# Altium project LIC_EPD_MB.PrjPcb
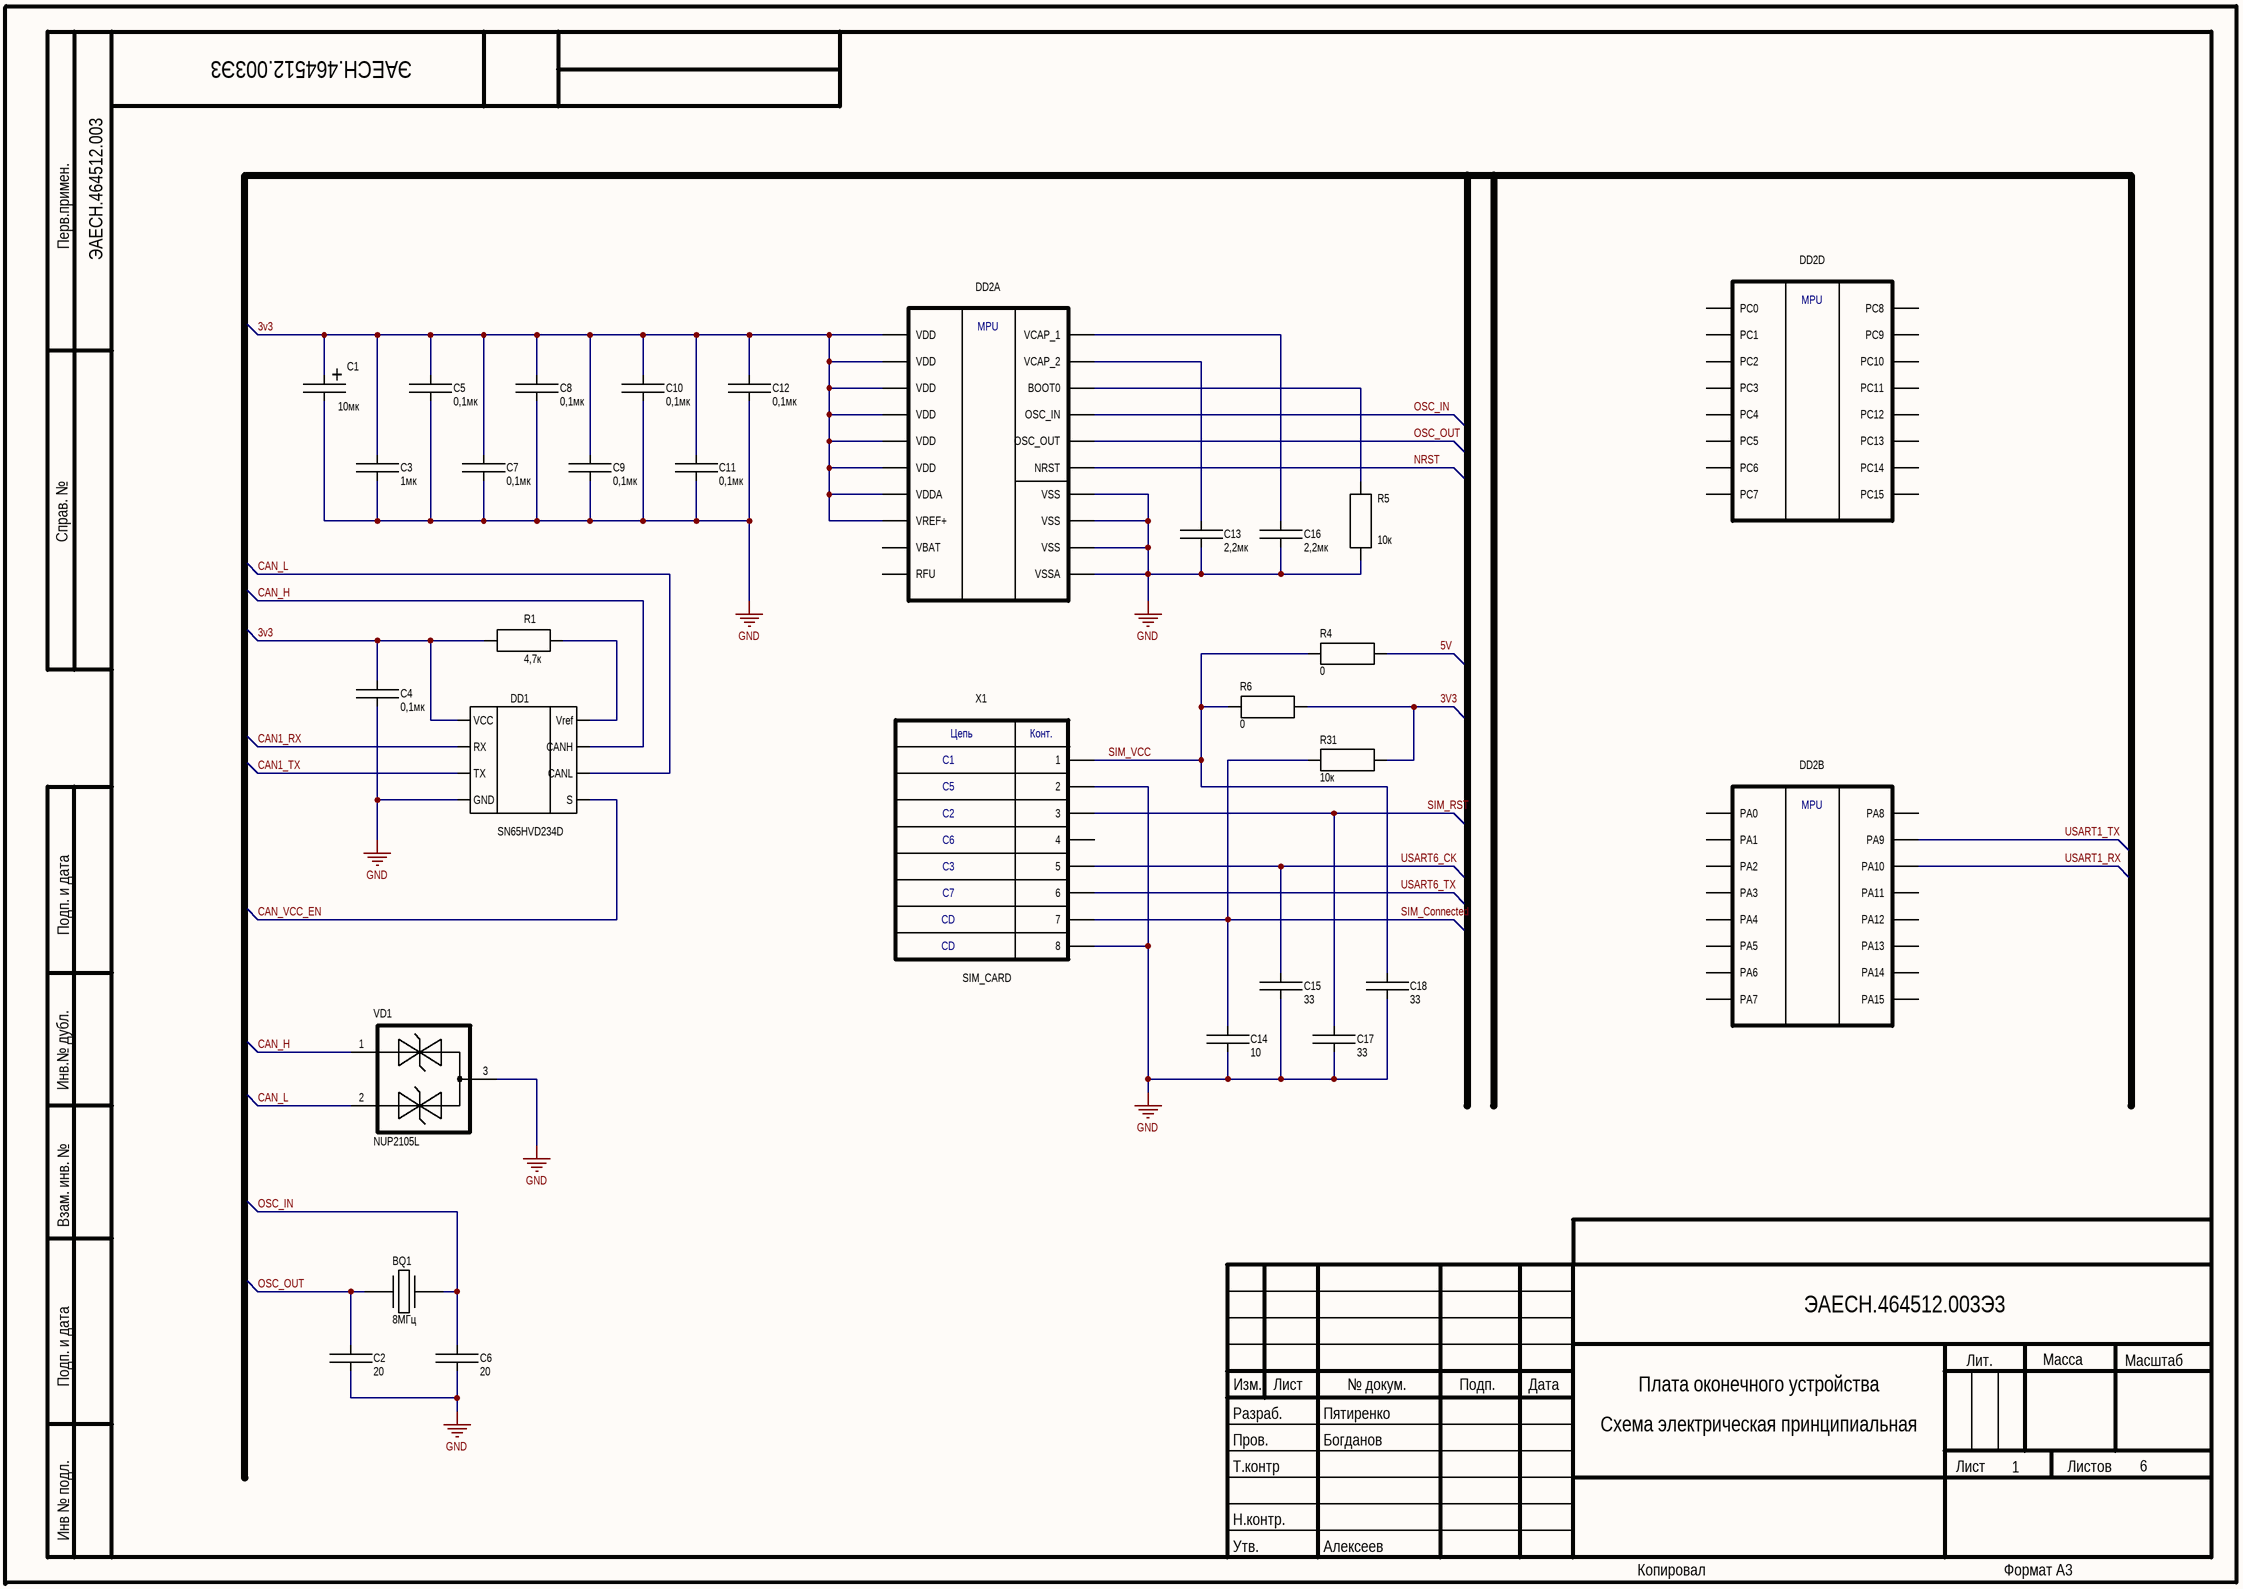
[diagram p0: Sheet1.SchDoc]
6 sheets, 190 parts. Net scope: global (net labels, ports and power ports of the same name join across sheets).
Board file: PCB1.PcbDoc
Sheets:
  Sheet1.SchDoc
  Sheet2.SchDoc
  Sheet3.SchDoc
  Sheet4.SchDoc
  Sheet5.SchDoc
  Sheet6.SchDoc

## Sheet Sheet1.SchDoc: Плата оконечного устройства
size 420 x 297 mm; ApprovedBy: Алексеев; CheckedBy: Богданов; Author: Пятиренко; DrawnBy: Пятиренко; DocumentNumber: ЭАЕСН.464512.003Э3; SheetNumber: 1; SheetTotal: 6; PERVICH PRIM: ЭАЕСН.464512.003; Title2: Схема электрическая принципиальная; DocumentName: Sheet1.SCHDOC; Application_BuildNumber: sdfsdfsdfsdfsdfs

### Parts
BQ1  value 8МГц  [Crystal_0532]  (hidden comment: Quarz)
C1  value 10мк  [Case A]  (hidden comment: C_el)
C2  value 20  [С0603]  (hidden comment: C)
C3  value 1мк  [С0603]  (hidden comment: C)
C4  value 0,1мк  [С0603]  (hidden comment: C)
C5  value 0,1мк  [С0603]  (hidden comment: C)
C6  value 20  [С0603]  (hidden comment: C)
C7  value 0,1мк  [С0603]  (hidden comment: C)
C8  value 0,1мк  [С0603]  (hidden comment: C)
C9  value 0,1мк  [С0603]  (hidden comment: C)
C10  value 0,1мк  [С0603]  (hidden comment: C)
C11  value 0,1мк  [С0603]  (hidden comment: C)
C12  value 0,1мк  [С0603]  (hidden comment: C)
C13  value 2,2мк  [С0603]  (hidden comment: C)
C14  value 10  [С0603]  (hidden comment: C)
C15  value 33  [С0603]  (hidden comment: C)
C16  value 2,2мк  [С0603]  (hidden comment: C)
C17  value 33  [С0603]  (hidden comment: C)
C18  value 33  [С0603]  (hidden comment: C)
DD1  SN65HVD234D  [SOIC8]
DD2  STM32F207VCTx  [LQFP100]  (value not drawn)  (parts A,B,D of 6)
R1  value 4,7к  [R0603]  (hidden comment: R)
R4  value 0  [R0603]  (hidden comment: R)
R5  value 10к  [R0603]  (hidden comment: R)
R6  value 0  [R0603]  (hidden comment: R)
R31  value 10к  [R0603]  (hidden comment: R)
VD1  NUP2105L  [SOT-23]
X1  SIM_CARD  [SIM_CARD_READER2]

### Nets
GND: C1.2 C2.2 C3.2 C4.2 C5.2 C6.2 C7.2 C8.2 C9.2 C10.2 C11.2 C12.2 C13.2 C14.2 C15.2 C16.2 C17.2 C18.2 DD1.2(GND) DD2.10(VSS) DD2.20(VSSA) DD2.27(VSS) DD2.74(VSS) R5.2 VD1.3(AC) X1.2 X1.8
3v3: C1.1 C3.1 C4.1 C5.1 C7.1 C8.1 C9.1 C10.1 C11.1 C12.1 DD1.3(VCC) DD2.11(VDD) DD2.19(VDD) DD2.21(VREF+) DD2.22(VDDA) DD2.28(VDD) DD2.50(VDD) DD2.75(VDD) DD2.100(VDD) R1.1 R6.2 R31.2
5V: R4.2
CAN1_RX: DD1.4(RX)
CAN1_TX: DD1.1(TX)
CAN_H: DD1.7(CANH) VD1.1(A)
CAN_L: DD1.6(CANL) VD1.2(C)
CAN_VCC_EN: DD1.8(S)
NRST: DD2.14(NRST)
OSC_IN: BQ1.2 C6.1 DD2.12(OSC_IN)
OSC_OUT: BQ1.1 C2.1 DD2.13(OSC_OUT)
SIM_Connected: C14.1 R31.1 X1.7
SIM_RST: C17.1 X1.3
SIM_VCC: C18.1 R4.1 R6.1 X1.1
USART1_RX: DD2.69(PA10)
USART1_TX: DD2.68(PA9)
USART6_CK: C15.1 X1.5
USART6_TX: X1.6
NetC13_1: C13.1 DD2.73(VCAP_2)
NetC16_1: C16.1 DD2.49(VCAP_1)
NetDD1_5: DD1.5(Vref) R1.2
NetDD2_94: DD2.94(BOOT0) R5.1

Not connected (* = marked no-connect by the designer): DD2 6(VBAT) 7(PC13) 8(PC14) 9(PC15) 15(PC0) 16(PC1) 17(PC2) 18(PC3) 23(PA0) 24(PA1) 25(PA2) 26(PA3) 29(PA4) 30(PA5) 31(PA6) 32(PA7) 33(PC4) 34(PC5) 63(PC6) 64(PC7) 65(PC8) 66(PC9) 67(PA8) 70(PA11) 71(PA12) 72(PA13) 76(PA14) 77(PA15) 78(PC10) 79(PC11) 80(PC12) 99(RFU); X1 4

### Notes on the sheet
- Перв.примен.
- Справ. №
- Подп. и дата
- Инв.№ дубл.
- Взам. инв. №
- Изм.
- Лист
- № докум.
- Подп.
- Дата
- Лит.
- Масса
- Масштаб
- Пров.
- Т.контр
- Разраб.
- Листов
- Инв № подл.
- Н.контр.
- Утв.
- Копировал
- Формат А3
- (in symbol C_el) +
- (in symbol SIM_CARD) Цепь; Конт.; С1; С5; С2; С6; С3; C7; CD
- (in symbol STM32F207VCTx, part A) MPU
- (in symbol STM32F207VCTx, part B) MPU
- (in symbol STM32F207VCTx, part D) MPU

## Sheet Sheet2.SchDoc
size 420 x 297 mm; DocumentNumber: ЭАЕСН.464512.003Э3; SheetNumber: 2; SheetTotal: x; DocumentName: Sheet1.SCHDOC
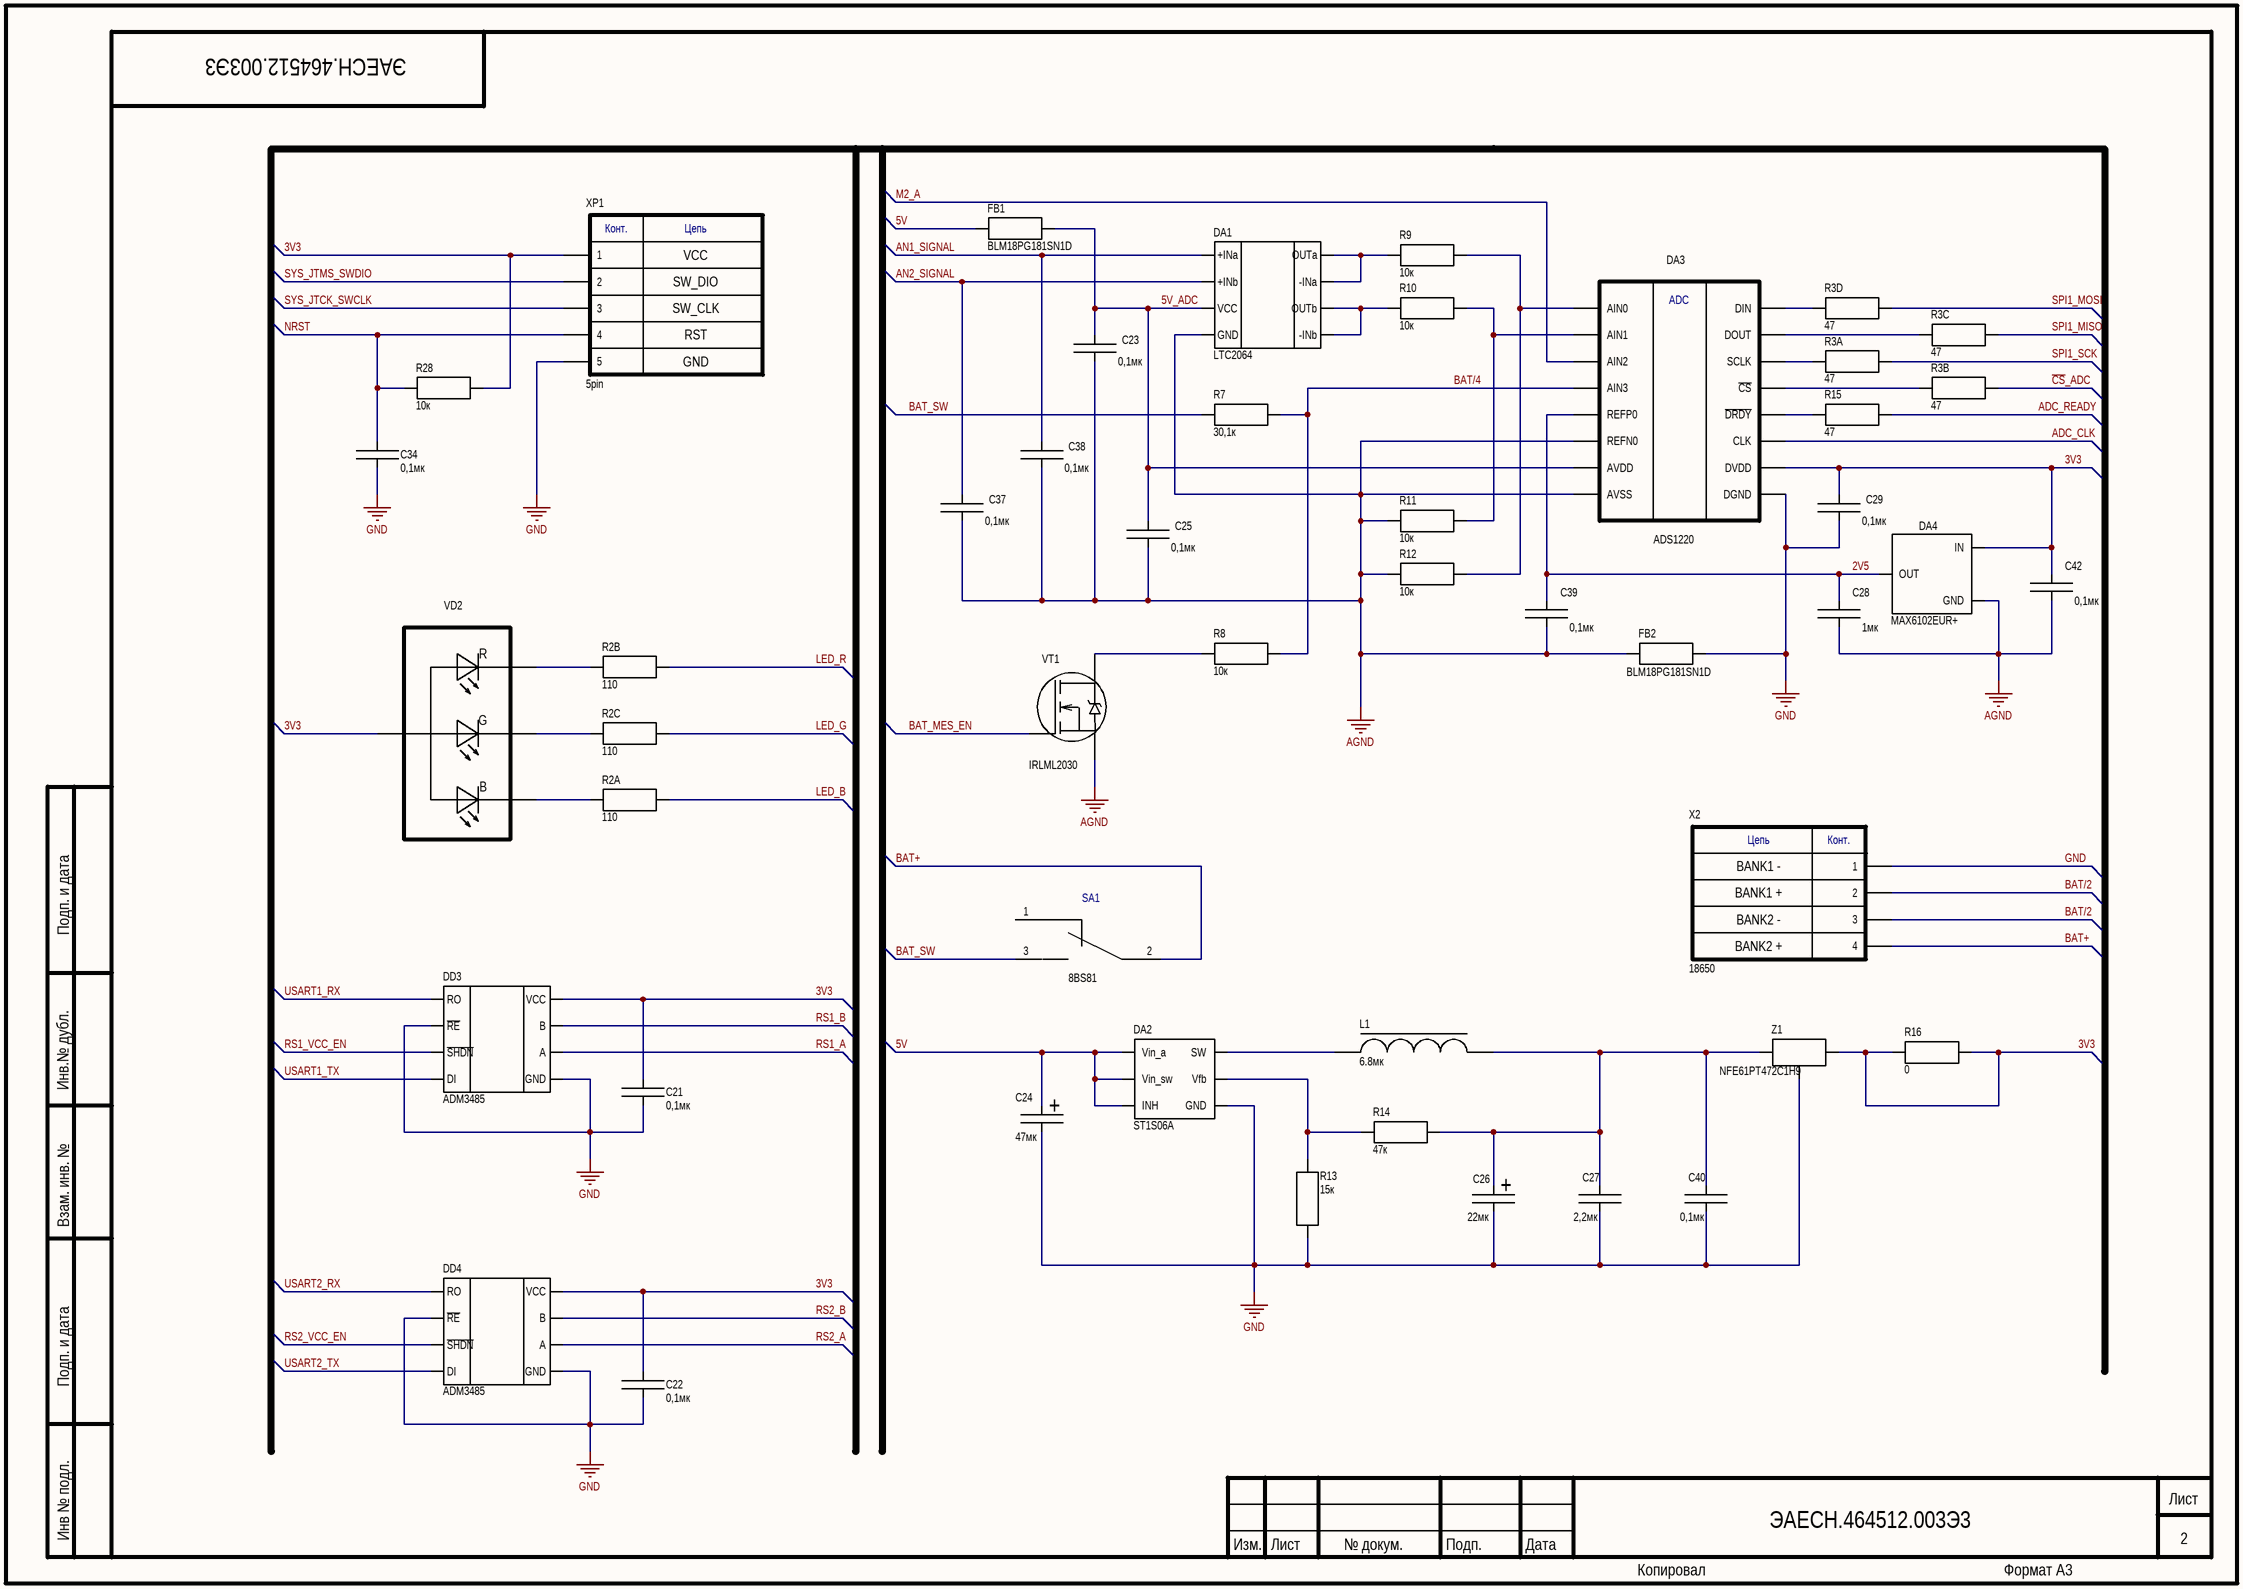
[diagram p1: Sheet2.SchDoc]

### Parts
C21  value 0,1мк  [С0603]  (hidden comment: C)
C22  value 0,1мк  [С0603]  (hidden comment: C)
C23  value 0,1мк  [С0603]  (hidden comment: C)
C24  value 47мк  [CASE B]  (hidden comment: C_el)
C25  value 0,1мк  [С0603]  (hidden comment: C)
C26  value 22мк  [Case A]  (hidden comment: C_el)
C27  value 2,2мк  [С0603]  (hidden comment: C)
C28  value 1мк  [С0603]  (hidden comment: C)
C29  value 0,1мк  [С0603]  (hidden comment: C)
C34  value 0,1мк  [С0603]  (hidden comment: C)
C37  value 0,1мк  [С0603]  (hidden comment: C)
C38  value 0,1мк  [С0603]  (hidden comment: C)
C39  value 0,1мк  [С0603]  (hidden comment: C)
C40  value 0,1мк  [С0603]  (hidden comment: C)
C42  value 0,1мк  [С0603]  (hidden comment: C)
DA1  LTC2064  [MSOP8]
DA2  ST1S06A  [DFN6]
DA3  ADS1220  [TSSOP-16]
DA4  MAX6102EUR+  [SOT-23]
DD3  ADM3485  [SOIC8]
DD4  ADM3485  [SOIC8]
FB1  BLM18PG181SN1D  [R0603]
FB2  BLM18PG181SN1D  [R0603]
L1  6.8мк  [Ind_6.5x6.5]
R2  value 110  [CAT16]  (hidden comment: RES_4)  (parts A,B,C of 4)
R3  value 47  [CAT16]  (hidden comment: RES_4)  (parts A,B,C,D of 4)
R7  value 30,1к  [R0603]  (hidden comment: R)
R8  value 10к  [R0603]  (hidden comment: R)
R9  value 10к  [R0603]  (hidden comment: R)
R10  value 10к  [R0603]  (hidden comment: R)
R11  value 10к  [R0603]  (hidden comment: R)
R12  value 10к  [R0603]  (hidden comment: R)
R13  value 15к  [R0603]  (hidden comment: R)
R14  value 47к  [R0603]  (hidden comment: R)
R15  value 47  [R0603]  (hidden comment: R)
R16  value 0  [R1206]  (hidden comment: R)
R28  value 10к  [R0603]  (hidden comment: R)
SA1  8BS81  [SMTS-102]
VD2  FYLS-3528RGBC  [LED_RGB]  (value not drawn)
VT1  IRLML2030  [SOT-23]
X2  18650  [18650_holder]
XP1  5pin  [PLS-5]
Z1  NFE61PT472C1H9  [NFE61P]

### Nets
AGND: C23.2 C25.2 C28.2 C37.2 C38.2 C39.2 C42.2 DA1.4(GND) DA3.5(AVSS) DA3.8(REFN0) DA4.3(GND) FB2.1 R11.2 R12.2 VT1.2(S)
GND: C21.2 C22.2 C24.2 C26.2 C27.2 C29.2 C34.2 C40.2 DA2.2(GND) DA3.4(DGND) DD3.2(~{RE}) DD3.5(GND) DD4.2(~{RE}) DD4.5(GND) FB2.2 R13.1 X2.1 XP1.5 Z1.3(GND)
2V5: C28.1 C39.1 DA3.9(REFP0) DA4.2(OUT)
3v3: C21.1 C22.1 C29.1 C42.1 DA3.13(DVDD) DA4.1(IN) DD3.8(VCC) DD4.8(VCC) R16.1 R16.2 R28.2 VD2.2 XP1.1 Z1.2
5V: C24.1 DA2.4(Vin_sw) DA2.5(Vin_a) DA2.6(INH) FB1.2
5V_ADC: C23.1 C25.1 DA1.8(VCC) DA3.12(AVDD) FB1.1
ADC_CLK: DA3.3(CLK)
ADC_READY: R15.2
AN1_SIGNAL: C38.1 DA1.3(+INa)
AN2_SIGNAL: C37.1 DA1.5(+INb)
BAT+: SA1.2 X2.4
BAT/2: X2.2 X2.3
BAT/4: DA3.6(AIN3) R7.2 R8.2
BAT_MES_EN: VT1.1(G)
BAT_SW: R7.1 SA1.3
~{CS}_ADC: R3.7
LED_B: R2.8
LED_G: R2.6
LED_R: R2.7
M2_A: DA3.7(AIN2)
NRST: C34.1 R28.1 XP1.4
RS1_A: DD3.6(A)
RS1_B: DD3.7(B)
RS1_VCC_EN: DD3.3(~{SHDN})
RS2_A: DD4.6(A)
RS2_B: DD4.7(B)
RS2_VCC_EN: DD4.3(~{SHDN})
SPI1_MISO: R3.6
SPI1_MOSI: R3.5
SPI1_SCK: R3.8
SYS_JTCK_SWCLK: XP1.3
SYS_JTMS_SWDIO: XP1.2
USART1_RX: DD3.1(RO)
USART1_TX: DD3.4(DI)
USART2_RX: DD4.1(RO)
USART2_TX: DD4.4(DI)
NetC26_1: C26.1 C27.1 C40.1 L1.1 R14.2 Z1.1
NetDA1_1: DA1.1(OUTa) DA1.2(-INa) R9.1
NetDA1_6: DA1.6(-INb) DA1.7(OUTb) R10.1
NetDA2_1: DA2.1(Vfb) R13.2 R14.1
NetDA2_3: DA2.3(SW) L1.2
NetDA3_1: DA3.1(SCLK) R3.1
NetDA3_2: DA3.2(~{CS}) R3.2
NetDA3_10: DA3.10(AIN1) R10.2 R11.1
NetDA3_11: DA3.11(AIN0) R9.2 R12.1
NetDA3_14: DA3.14(~{DRDY}) R15.1
NetDA3_15: DA3.15(DOUT) R3.3
NetDA3_16: DA3.16(DIN) R3.4
NetR2_1: R2.1 VD2.3
NetR2_2: R2.2 VD2.1
NetR2_3: R2.3 VD2.4
NetR8_1: R8.1 VT1.3(D)

Not connected (* = marked no-connect by the designer): SA1 1

### Notes on the sheet
- VCC
- SW_DIO
- SW_CLK
- RST
- GND
- Подп. и дата
- Инв.№ дубл.
- Взам. инв. №
- Инв № подл.
- Изм.
- Лист
- № докум.
- Подп.
- Дата
- Копировал
- Формат А3
- (in symbol 5pin) Конт.; Цепь
- (in symbol 18650_holder) Цепь; Конт.; BANK1 -; BANK1 +; BANK2 -; BANK2 +
- (in symbol ADC1220) ADC
- (in symbol C_el) +
- (in symbol LED_RGB) R; G; B

### Library data of the parts
DA3 = ADC1220
DD3 DD4 = MAX13487: RS485
FB1 FB2 = R: Value: 0
L1 = L
SA1 = Button
VD2 = LED_RGB
VT1 = N-channel
X2 = 18650_holder
Z1 = Filter

## Sheet Sheet3.SchDoc
size 420 x 297 mm; DocumentNumber: ЭАЕСН.464512.003Э3; SheetNumber: 3; SheetTotal: x; DocumentName: Sheet1.SCHDOC
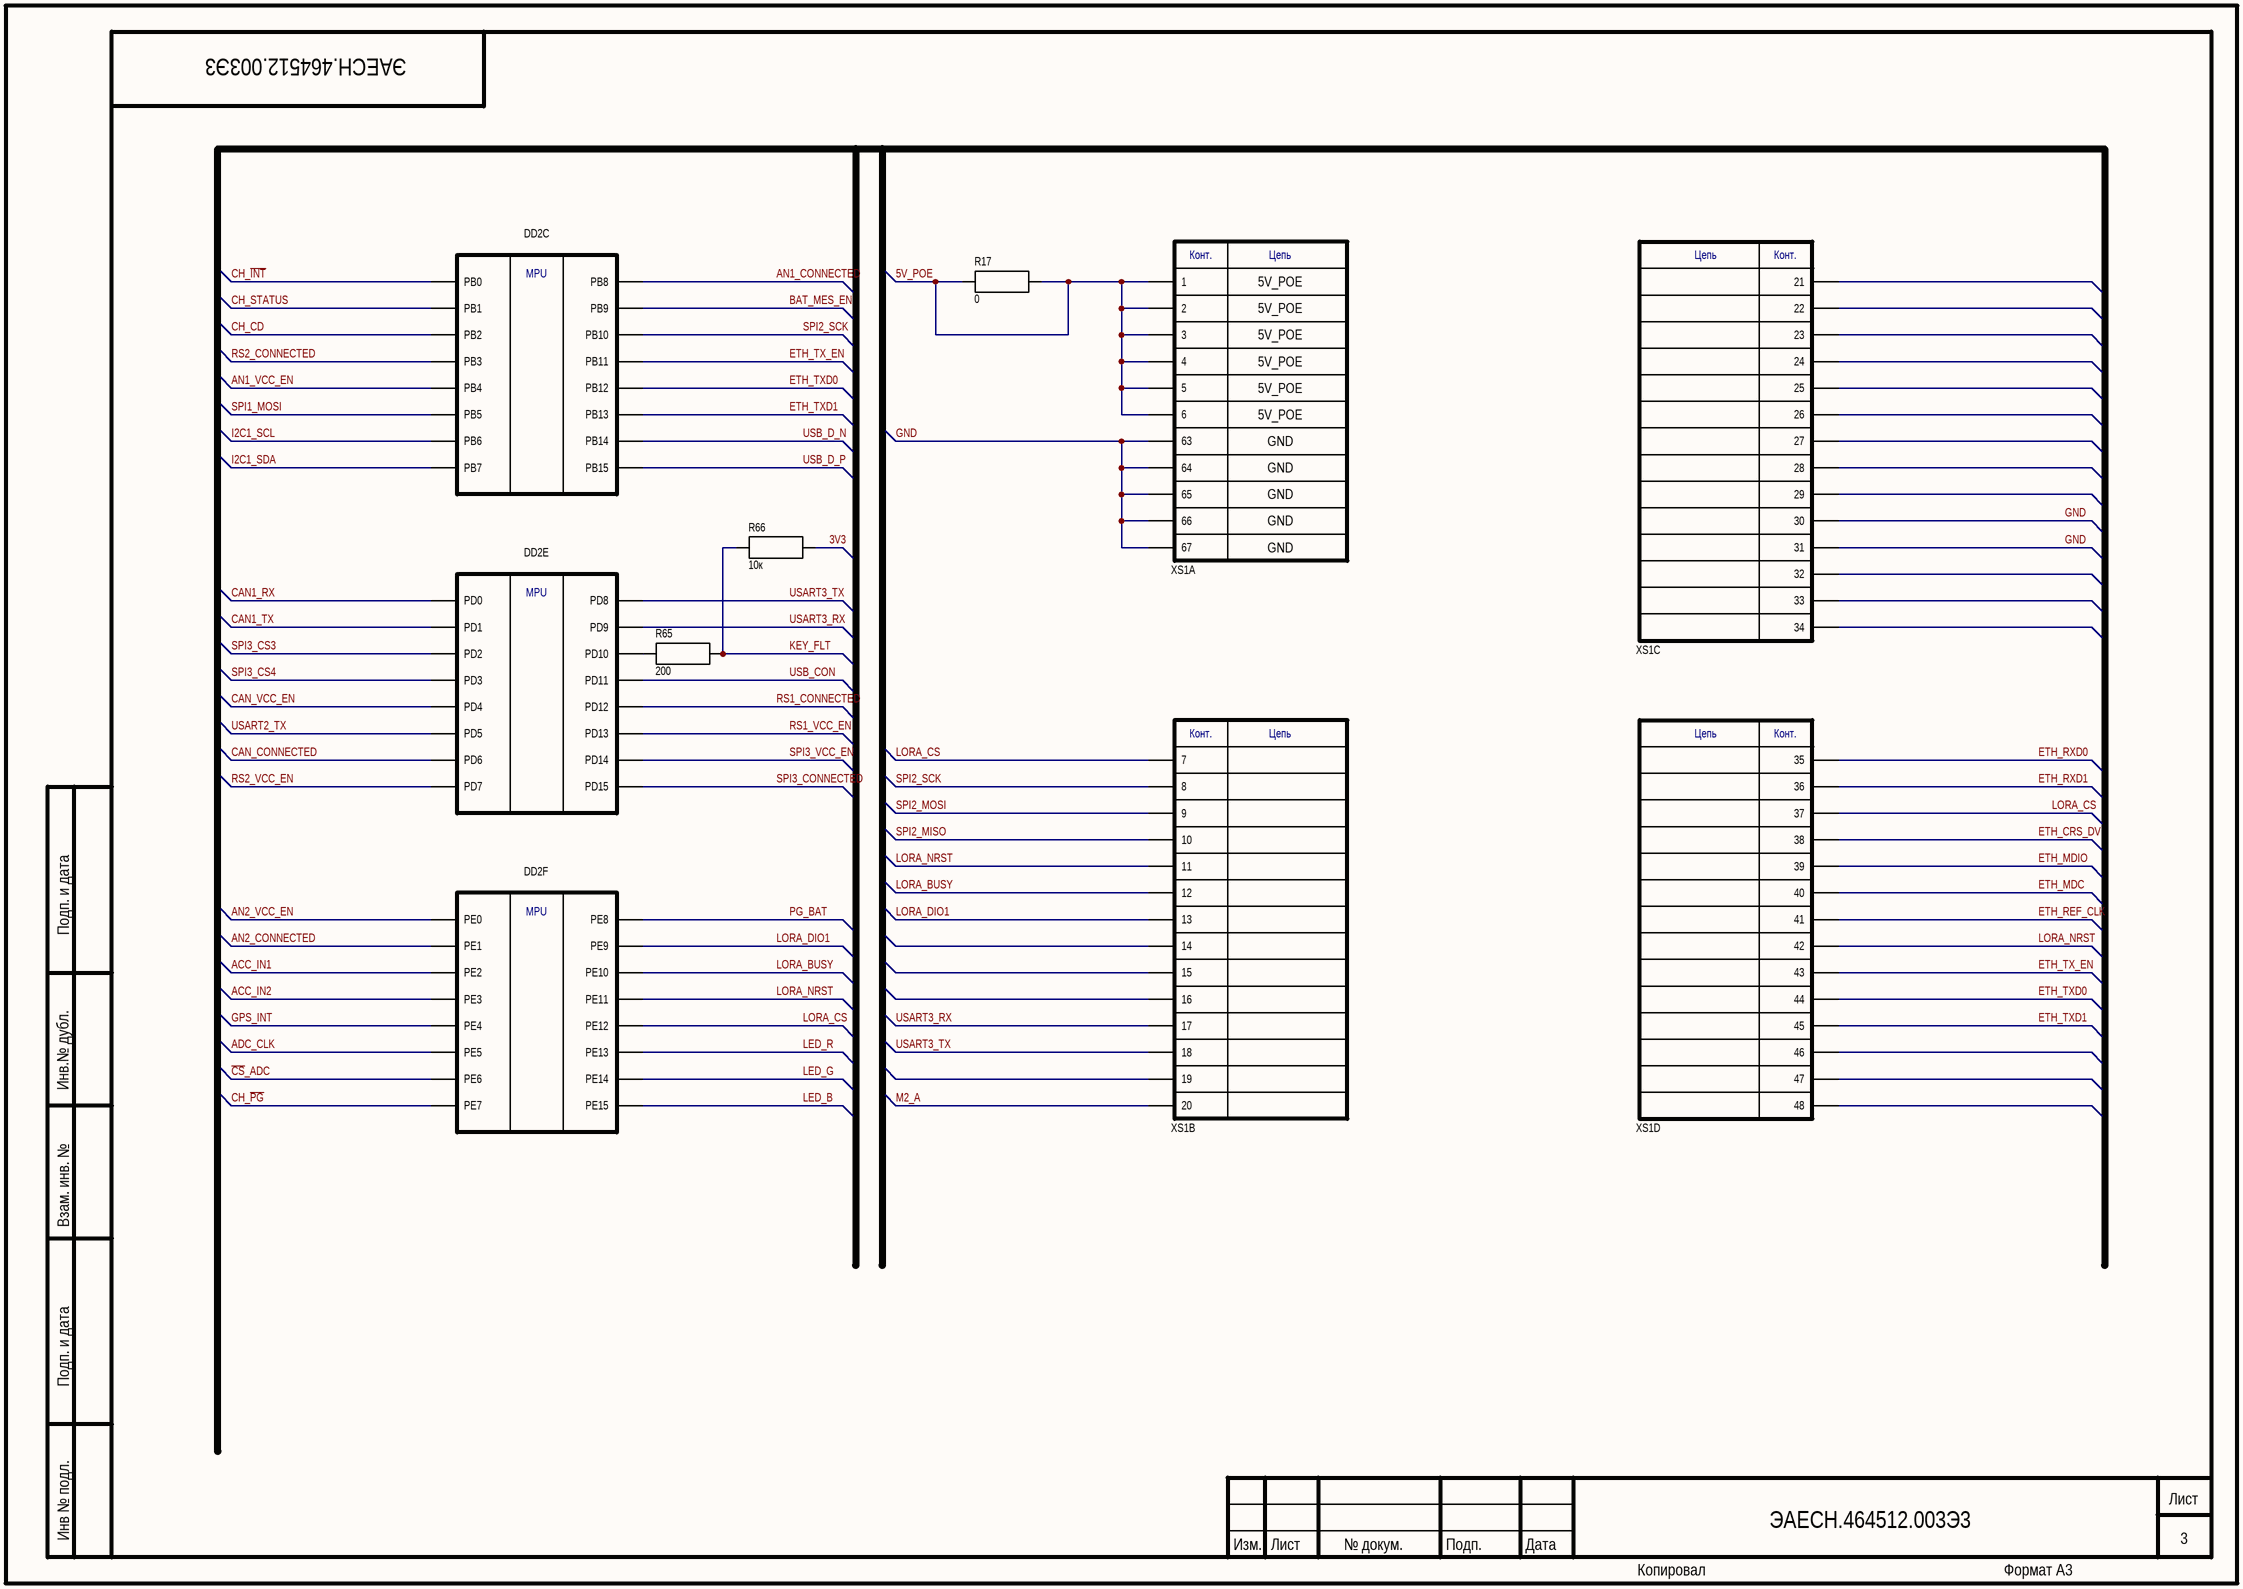
[diagram p2: Sheet3.SchDoc]

### Parts
DD2  STM32F207VCTx  [LQFP100]  (value not drawn)  (parts C,E,F of 6)
R17  value 0  [R1206]  (hidden comment: R)
R65  value 200  [R0603]  (hidden comment: R)
R66  value 10к  [R0603]  (hidden comment: R)
XS1  M.2  [M.2]  (value not drawn)  (parts A,B,C,D of 5)

### Nets
GND: XS1.30 XS1.31 XS1.63 XS1.64 XS1.65 XS1.66 XS1.67
3v3: R66.2
5V_POE: R17.1 R17.2 XS1.1 XS1.2 XS1.3 XS1.4 XS1.5 XS1.6
ACC_IN1: DD2.1(PE2)
ACC_IN2: DD2.2(PE3)
ADC_CLK: DD2.4(PE5)
AN1_CONNECTED: DD2.95(PB8)
AN1_VCC_EN: DD2.90(PB4)
AN2_CONNECTED: DD2.98(PE1)
AN2_VCC_EN: DD2.97(PE0)
BAT_MES_EN: DD2.96(PB9)
~{CS}_ADC: DD2.5(PE6)
CAN1_RX: DD2.81(PD0)
CAN1_TX: DD2.82(PD1)
CAN_CONNECTED: DD2.87(PD6)
CAN_VCC_EN: DD2.85(PD4)
CH_CD: DD2.37(PB2)
CH_~{INT}: DD2.35(PB0)
CH_~{PG}: DD2.38(PE7)
CH_STATUS: DD2.36(PB1)
ETH_CRS_DV: XS1.38
ETH_MDC: XS1.40
ETH_MDIO: XS1.39
ETH_REF_CLK: XS1.41
ETH_RXD0: XS1.35
ETH_RXD1: XS1.36
ETH_TX_EN: DD2.48(PB11) XS1.43
ETH_TXD0: DD2.51(PB12) XS1.44
ETH_TXD1: DD2.52(PB13) XS1.45
GPS_INT: DD2.3(PE4)
I2C1_SCL: DD2.92(PB6)
I2C1_SDA: DD2.93(PB7)
KEY_FLT: R65.2 R66.1
LED_B: DD2.46(PE15)
LED_G: DD2.45(PE14)
LED_R: DD2.44(PE13)
LORA_BUSY: DD2.41(PE10) XS1.12
LORA_CS: DD2.43(PE12) XS1.7 XS1.37
LORA_DIO1: DD2.40(PE9) XS1.13
LORA_NRST: DD2.42(PE11) XS1.11 XS1.42
M2_A: XS1.20
PG_BAT: DD2.39(PE8)
RS1_CONNECTED: DD2.59(PD12)
RS1_VCC_EN: DD2.60(PD13)
RS2_CONNECTED: DD2.89(PB3)
RS2_VCC_EN: DD2.88(PD7)
SPI1_MOSI: DD2.91(PB5)
SPI2_MISO: XS1.10
SPI2_MOSI: XS1.9
SPI2_SCK: DD2.47(PB10) XS1.8
SPI3_CONNECTED: DD2.62(PD15)
SPI3_CS3: DD2.83(PD2)
SPI3_CS4: DD2.84(PD3)
SPI3_VCC_EN: DD2.61(PD14)
USART2_TX: DD2.86(PD5)
USART3_RX: DD2.56(PD9) XS1.17
USART3_TX: DD2.55(PD8) XS1.18
USB_CON: DD2.58(PD11)
USB_D_N: DD2.53(PB14)
USB_D_P: DD2.54(PB15)
NetDD2_57: DD2.57(PD10) R65.1

Not connected (* = marked no-connect by the designer): XS1 14 15 16 19 21 22 23 24 25 26 27 28 29 32 33 34 46 47 48

### Notes on the sheet
- 5V_POE
- GND
- Подп. и дата
- Инв.№ дубл.
- Взам. инв. №
- Инв № подл.
- Изм.
- Лист
- № докум.
- Подп.
- Дата
- Копировал
- Формат А3
- (in symbol M.2, part A) Конт.; Цепь
- (in symbol M.2, part B) Конт.; Цепь
- (in symbol M.2, part C) Цепь; Конт.
- (in symbol M.2, part D) Цепь; Конт.
- (in symbol STM32F207VCTx, part C) MPU
- (in symbol STM32F207VCTx, part E) MPU
- (in symbol STM32F207VCTx, part F) MPU

## Sheet Sheet4.SchDoc
size 420 x 297 mm; DocumentNumber: ЭАЕСН.464512.003Э3; SheetNumber: 4; SheetTotal: x; DocumentName: Sheet1.SCHDOC
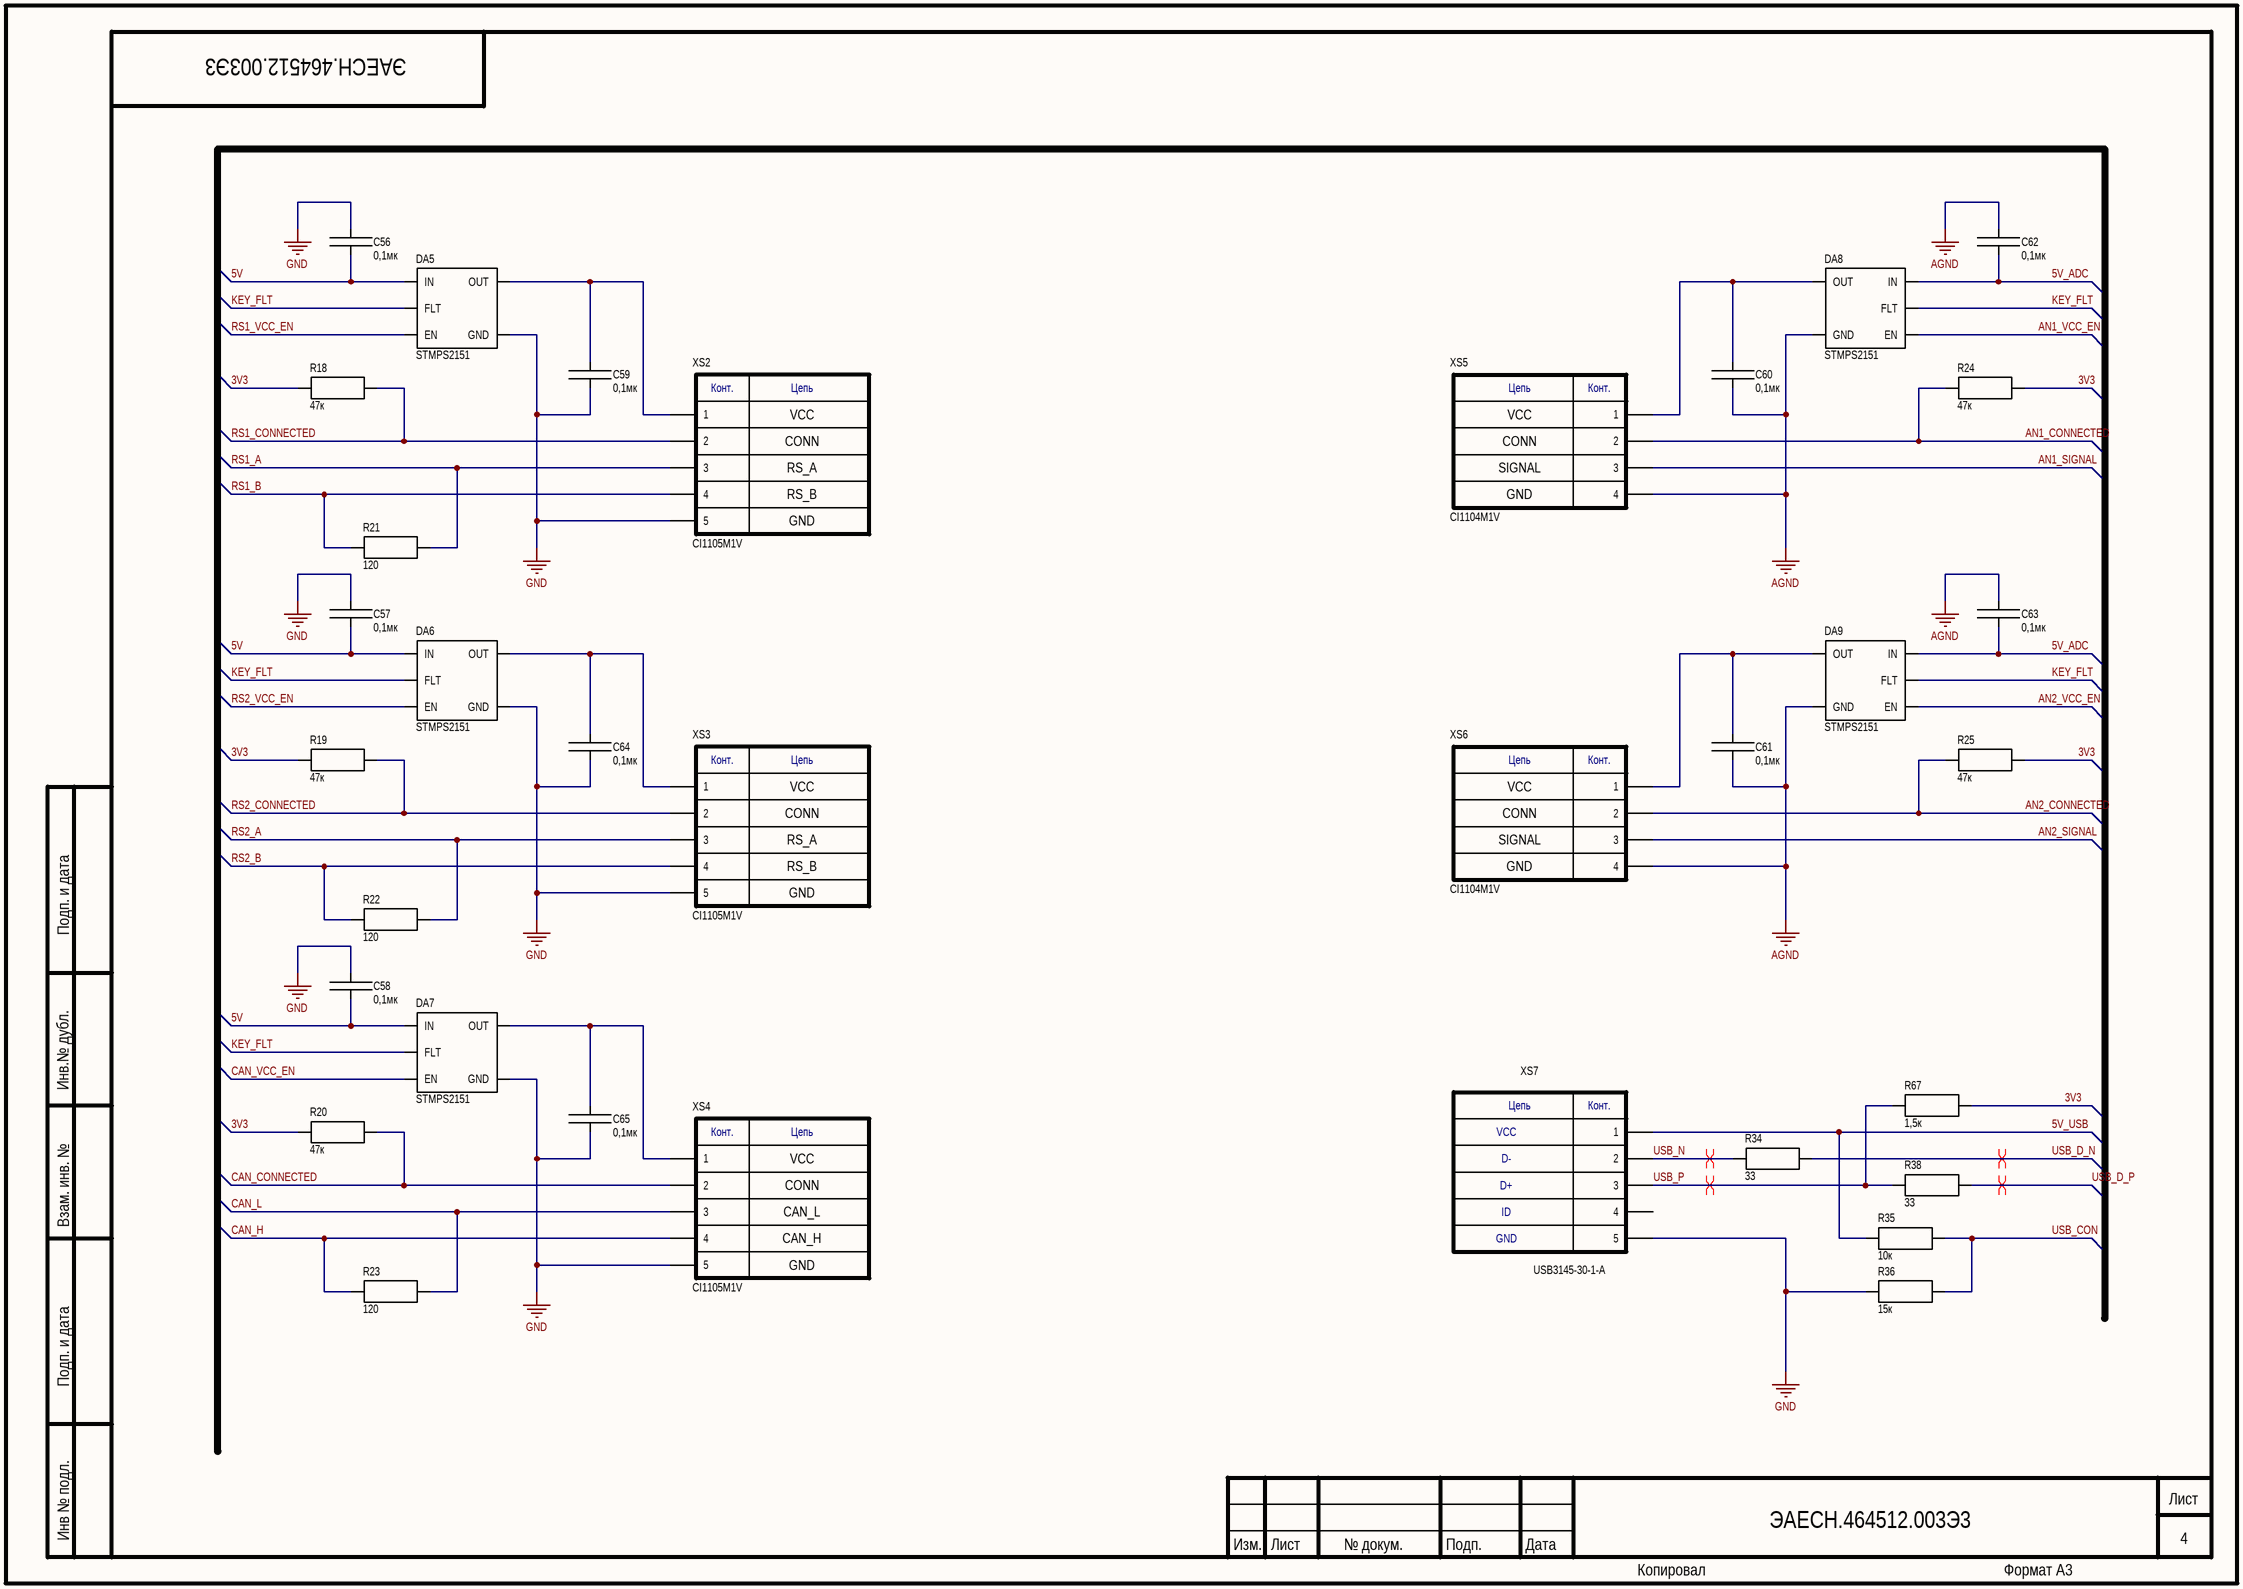
[diagram p3: Sheet4.SchDoc]

### Parts
C56  value 0,1мк  [С0603]  (hidden comment: C)
C57  value 0,1мк  [С0603]  (hidden comment: C)
C58  value 0,1мк  [С0603]  (hidden comment: C)
C59  value 0,1мк  [С0603]  (hidden comment: C)
C60  value 0,1мк  [С0603]  (hidden comment: C)
C61  value 0,1мк  [С0603]  (hidden comment: C)
C62  value 0,1мк  [С0603]  (hidden comment: C)
C63  value 0,1мк  [С0603]  (hidden comment: C)
C64  value 0,1мк  [С0603]  (hidden comment: C)
C65  value 0,1мк  [С0603]  (hidden comment: C)
DA5  STMPS2151  [SOT-23-5]
DA6  STMPS2151  [SOT-23-5]
DA7  STMPS2151  [SOT-23-5]
DA8  STMPS2151  [SOT-23-5]
DA9  STMPS2151  [SOT-23-5]
R18  value 47к  [R0603]  (hidden comment: R)
R19  value 47к  [R0603]  (hidden comment: R)
R20  value 47к  [R0603]  (hidden comment: R)
R21  value 120  [R1206]  (hidden comment: R)
R22  value 120  [R1206]  (hidden comment: R)
R23  value 120  [R1206]  (hidden comment: R)
R24  value 47к  [R0603]  (hidden comment: R)
R25  value 47к  [R0603]  (hidden comment: R)
R34  value 33  [R0603]  (hidden comment: R)
R35  value 10к  [R0603]  (hidden comment: R)
R36  value 15к  [R0603]  (hidden comment: R)
R38  value 33  [R0603]  (hidden comment: R)
R67  value 1,5к  [R0603]  (hidden comment: R)
XS2  CI1105M1V  [СI1105М1V]
XS3  CI1105M1V  [СI1105М1V]
XS4  CI1105M1V  [СI1105М1V]
XS5  СI1104М1V  [СI1104М1V]
XS6  СI1104М1V  [СI1104М1V]
XS7  USB3145-30-1-A  [USB3145-30-1]

### Nets
AGND: C60.2 C61.2 C62.1 C63.1 DA8.2(GND) DA9.2(GND) XS5.4 XS6.4
GND: C56.1 C57.1 C58.1 C59.2 C64.2 C65.2 DA5.2(GND) DA6.2(GND) DA7.2(GND) R36.1 XS2.5 XS3.5 XS4.5 XS7.5
3v3: R18.1 R19.1 R20.1 R24.1 R25.1 R67.2
5V: C56.2 C57.2 C58.2 DA5.5(IN) DA6.5(IN) DA7.5(IN)
5V_ADC: C62.2 C63.2 DA8.5(IN) DA9.5(IN)
5V_USB: R35.1 XS7.1
AN1_CONNECTED: R24.2 XS5.2
AN1_SIGNAL: XS5.3
AN1_VCC_EN: DA8.4(EN)
AN2_CONNECTED: R25.2 XS6.2
AN2_SIGNAL: XS6.3
AN2_VCC_EN: DA9.4(EN)
CAN_CONNECTED: R20.2 XS4.2
CAN_H: R23.1 XS4.4
CAN_L: R23.2 XS4.3
CAN_VCC_EN: DA7.4(EN)
KEY_FLT: DA5.3(FLT) DA6.3(FLT) DA7.3(FLT) DA8.3(FLT) DA9.3(FLT)
RS1_A: R21.2 XS2.3
RS1_B: R21.1 XS2.4
RS1_CONNECTED: R18.2 XS2.2
RS1_VCC_EN: DA5.4(EN)
RS2_A: R22.2 XS3.3
RS2_B: R22.1 XS3.4
RS2_CONNECTED: R19.2 XS3.2
RS2_VCC_EN: DA6.4(EN)
USB_CON: R35.2 R36.2
USB_D_N: R34.2
USB_D_P: R38.2
USB_N: R34.1 XS7.2
USB_P: R38.1 R67.1 XS7.3
NetC59_1: C59.1 DA5.1(OUT) XS2.1
NetC60_1: C60.1 DA8.1(OUT) XS5.1
NetC61_1: C61.1 DA9.1(OUT) XS6.1
NetC64_1: C64.1 DA6.1(OUT) XS3.1
NetC65_1: C65.1 DA7.1(OUT) XS4.1

Not connected (* = marked no-connect by the designer): XS7 4

### Layout directives
differential pair: USB_D_N, USB_D_P, USB_N, USB_P

### Notes on the sheet
- VCC
- CONN
- RS_A
- SIGNAL
- RS_B
- GND
- CAN_L
- CAN_H
- Подп. и дата
- Инв.№ дубл.
- Взам. инв. №
- Инв № подл.
- Изм.
- Лист
- № докум.
- Подп.
- Дата
- Копировал
- Формат А3
- (in symbol 4pin) Цепь; Конт.
- (in symbol 5pin) Конт.; Цепь
- (in symbol USB) Цепь; Конт.; VCC; D-; D+; ID; GND

### Library data of the parts
DA5-DA9 = STMPS21x1
XS2-XS4 = 5pin
XS5 XS6 = 4pin
XS7 = USB

## Sheet Sheet5.SchDoc
size 420 x 297 mm; DocumentNumber: ЭАЕСН.464512.003Э3; SheetNumber: 5; SheetTotal: x; DocumentName: Sheet1.SCHDOC
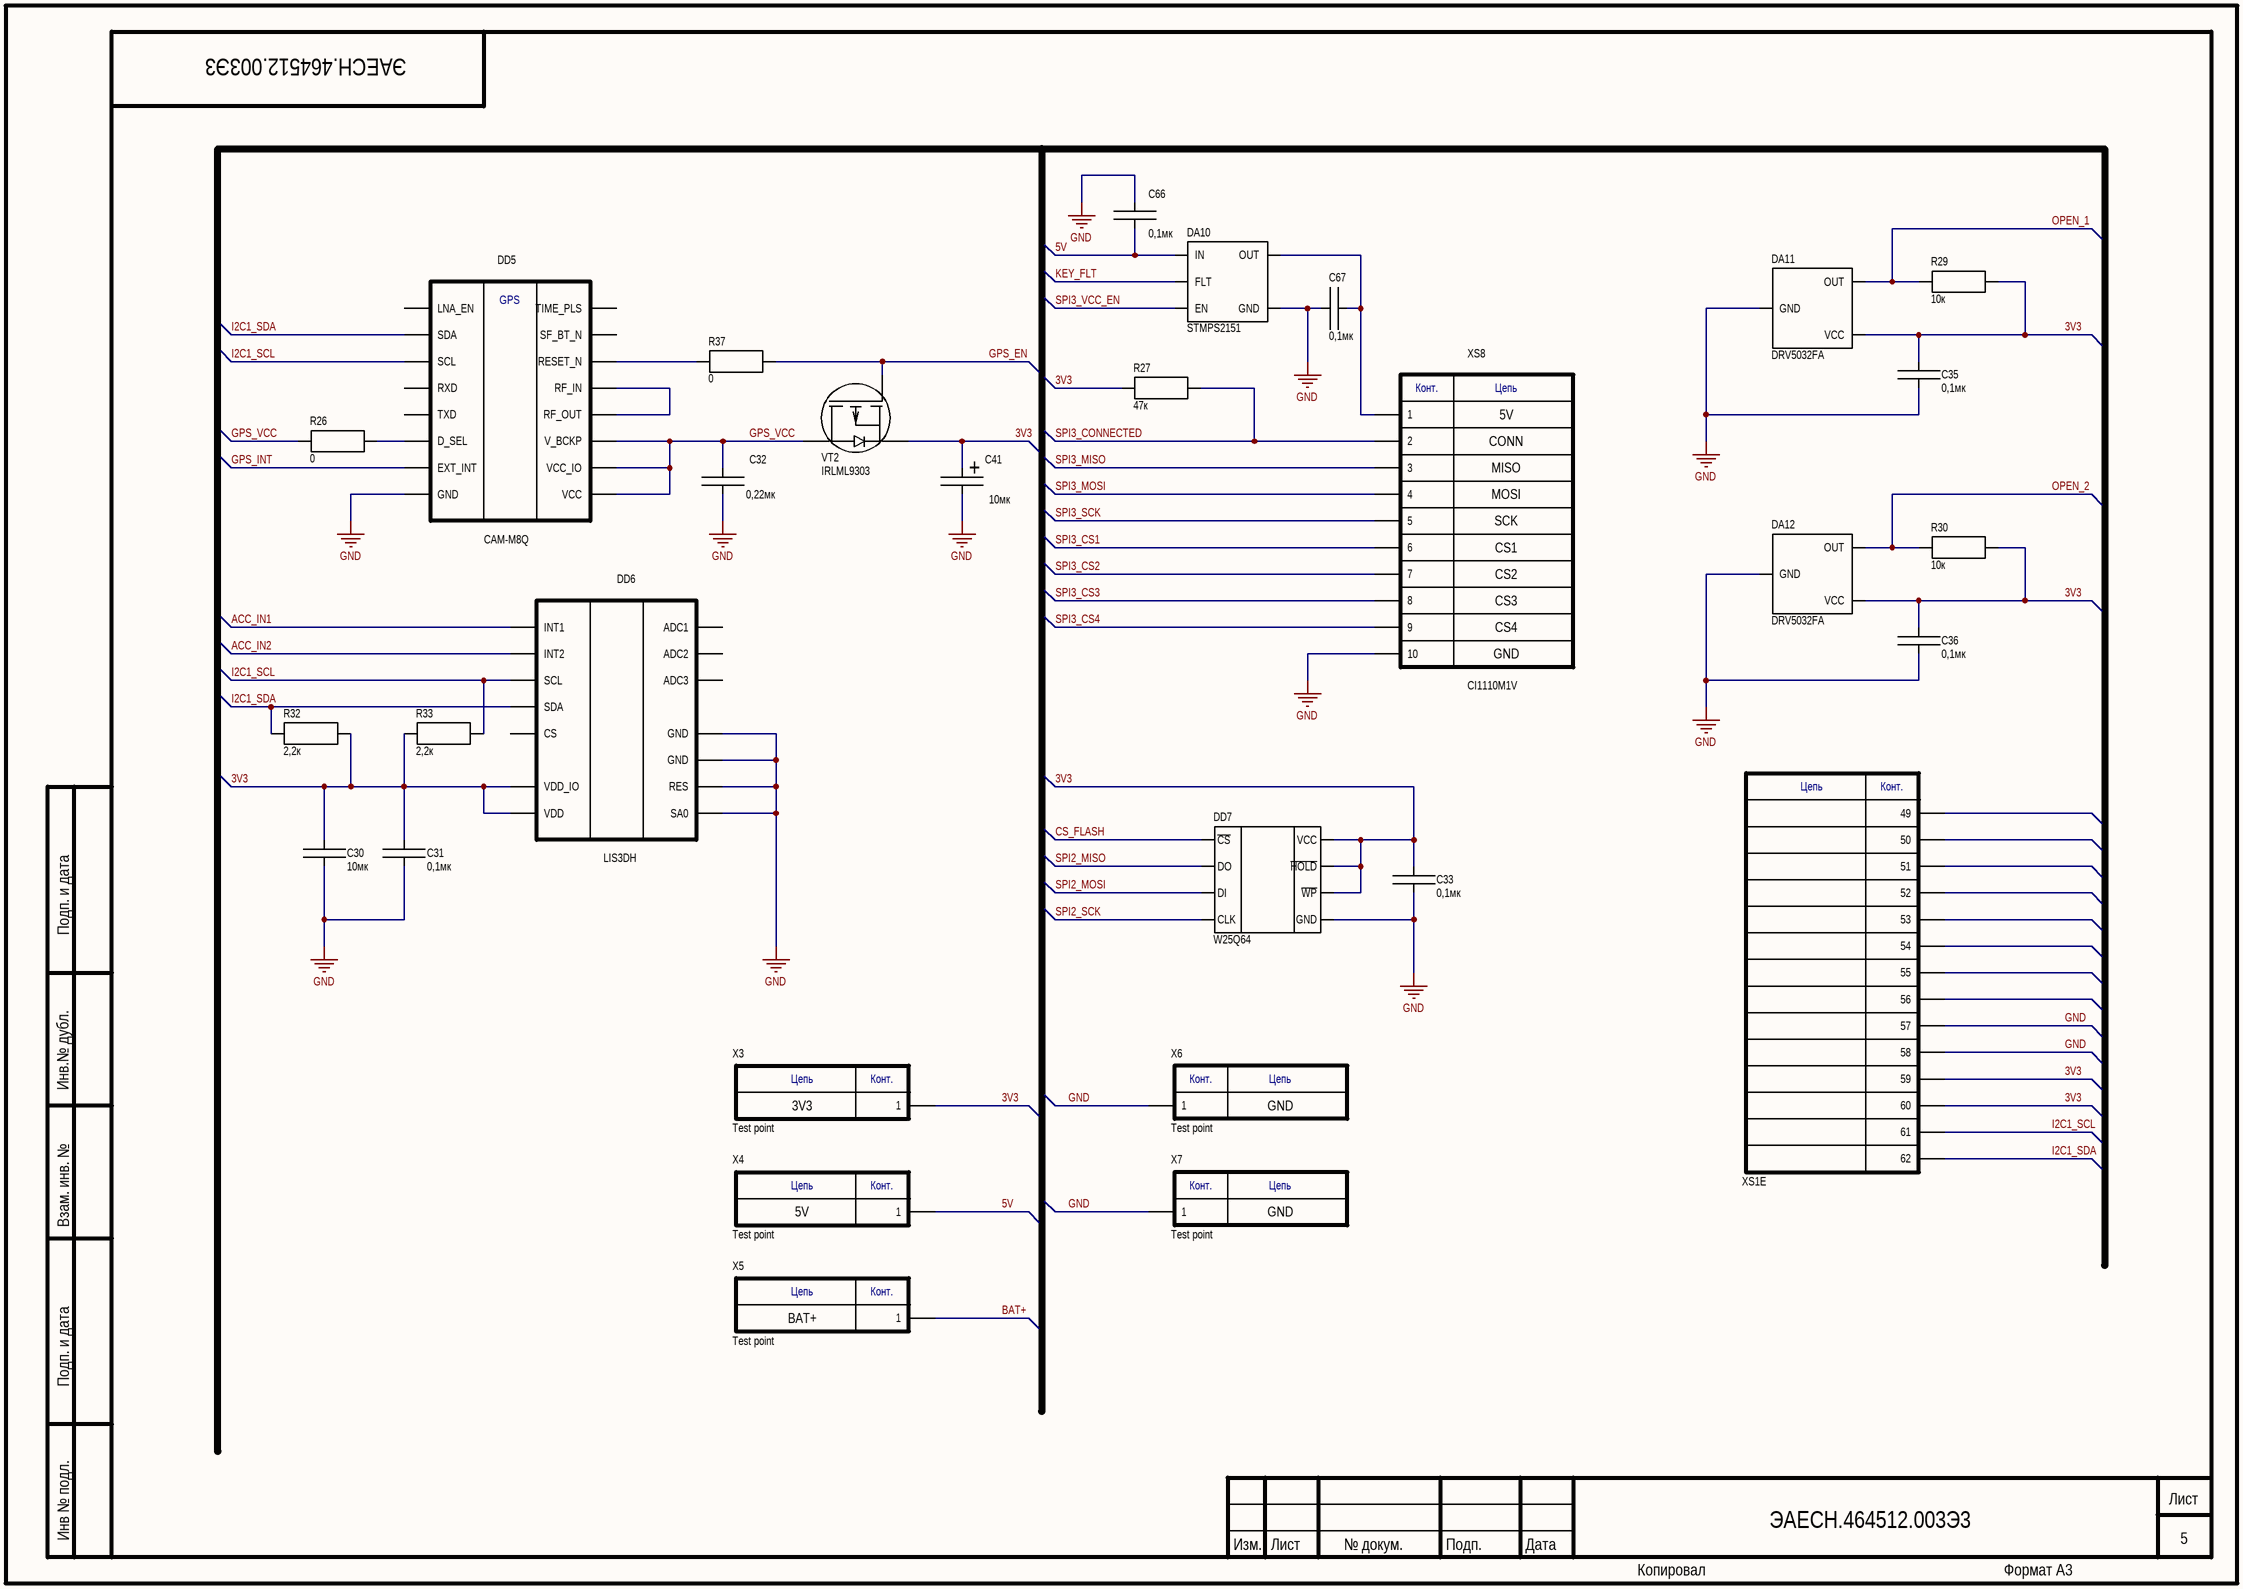
[diagram p4: Sheet5.SchDoc]

### Parts
C30  value 10мк  [С0603]  (hidden comment: C)
C31  value 0,1мк  [С0603]  (hidden comment: C)
C32  value 0,22мк  [С0603]  (hidden comment: C)
C33  value 0,1мк  [С0603]  (hidden comment: C)
C35  value 0,1мк  [С0603]  (hidden comment: C)
C36  value 0,1мк  [С0603]  (hidden comment: C)
C41  value 10мк  [Case A]  (hidden comment: C_el)
C66  value 0,1мк  [С0603]  (hidden comment: C)
C67  value 0,1мк  [С0603]  (hidden comment: C)
DA10  STMPS2151  [SOT-23-5]
DA11  DRV5032FA  [SOT-23]
DA12  DRV5032FA  [SOT-23]
DD5  CAM-M8Q  [CAM-M8Q]
DD6  LIS3DH  [LGA-16]
DD7  W25Q64  [SOIC8_208]
R26  value 0  [R0603]  (hidden comment: R)
R27  value 47к  [R0603]  (hidden comment: R)
R29  value 10к  [R0603]  (hidden comment: R)
R30  value 10к  [R0603]  (hidden comment: R)
R32  value 2,2к  [R0603]  (hidden comment: R)
R33  value 2,2к  [R0603]  (hidden comment: R)
R37  value 0  [R0603]  (hidden comment: R)
VT2  IRLML9303  [SOT-23]
X3  Test point  [Test_point]
X4  Test point  [Test_point]
X5  Test point  [Test_point]
X6  Test point  [Test_point]
X7  Test point  [Test_point]
XS1  M.2  [M.2]  (value not drawn)  (part E of 5)
XS8  СI1110М1V  [СI1110М1V]

### Nets
GND: C30.2 C31.2 C32.2 C33.2 C35.2 C36.2 C41.2 C66.1 C67.1 DA10.2(GND) DA11.3(GND) DA12.3(GND) DD5.4(GND) DD5.5(GND) DD5.10(GND) DD5.11(GND) DD5.12(GND) DD5.13(GND) DD5.14(GND) DD5.15(GND) DD5.18(GND) DD5.19(GND) DD5.21(GND) DD5.22(GND) DD5.27(GND) DD5.31(GND) DD6.5(GND) DD6.7(SA0) DD6.10(RES) DD6.12(GND) DD7.4(GND) X6.1 X7.1 XS1.57 XS1.58 XS8.10
3v3: C30.1 C31.1 C33.1 C35.1 C36.1 C41.1 DA11.1(VCC) DA12.1(VCC) DD6.1(VDD_IO) DD6.14(VDD) DD7.3(~{WP}) DD7.7(~{HOLD}) DD7.8(VCC) R27.1 R29.2 R30.2 R32.2 R33.1 VT2.2(S) X3.1 XS1.59 XS1.60
5V: C66.2 DA10.5(IN) X4.1
ACC_IN1: DD6.11(INT1)
ACC_IN2: DD6.9(INT2)
BAT+: X5.1
CS_FLASH: DD7.1(~{CS})
GPS_EN: R37.2 VT2.1(G)
GPS_INT: DD5.7(EXT_INT)
GPS_VCC: C32.1 DD5.1(VCC_IO) DD5.8(V_BCKP) DD5.9(VCC) R26.2 VT2.3(D)
I2C1_SCL: DD5.6(SCL) DD6.4(SCL) R33.2 XS1.61
I2C1_SDA: DD5.3(SDA) DD6.6(SDA) R32.1 XS1.62
KEY_FLT: DA10.3(FLT)
OPEN_1: DA11.2(OUT) R29.1
OPEN_2: DA12.2(OUT) R30.1
SPI2_MISO: DD7.2(DO)
SPI2_MOSI: DD7.5(DI)
SPI2_SCK: DD7.6(CLK)
SPI3_CONNECTED: R27.2 XS8.2
SPI3_CS1: XS8.6
SPI3_CS2: XS8.7
SPI3_CS3: XS8.8
SPI3_CS4: XS8.9
SPI3_MISO: XS8.3
SPI3_MOSI: XS8.4
SPI3_SCK: XS8.5
SPI3_VCC_EN: DA10.4(EN)
NetC67_2: C67.2 DA10.1(OUT) XS8.1
NetDD5_16: DD5.16(RF_OUT) DD5.17(RF_IN)
NetDD5_20: DD5.20(D_SEL) R26.1
NetDD5_23: DD5.23(RESET_N) R37.1

Not connected (* = marked no-connect by the designer): DD5 24(SF_BT_N) 25(TXD) 26(RXD) 29(TIME_PLS) 30(LNA_EN); DD6 8(CS) 13(ADC3) 15(ADC2) 16(ADC1); XS1 49 50 51 52 53 54 55 56

### Notes on the sheet
- 5V
- CONN
- MISO
- MOSI
- SCK
- CS1
- CS2
- CS3
- CS4
- GND
- 3V3
- BAT+
- Подп. и дата
- Инв.№ дубл.
- Взам. инв. №
- Инв № подл.
- Изм.
- Лист
- № докум.
- Подп.
- Дата
- Копировал
- Формат А3
- (in symbol 10pin) Конт.; Цепь
- (in symbol C_el) +
- (in symbol M.2, part E) Цепь; Конт.
- (in symbol Test_point) Конт.; Цепь

### Library data of the parts
DA10 = STMPS21x1
DA11 DA12 = DRV5032
DD5 = CAM-M8Q: GPS
DD6 = LIS3DH: Accelerometr
DD7 = W25Q64: RAM
VT2 = P-channel
X3-X7 = Test_point
XS8 = 10pin

## Sheet Sheet6.SchDoc
size 420 x 297 mm; DocumentNumber: ЭАЕСН.464512.003Э3; SheetNumber: 6; SheetTotal: x; DocumentName: Sheet1.SCHDOC
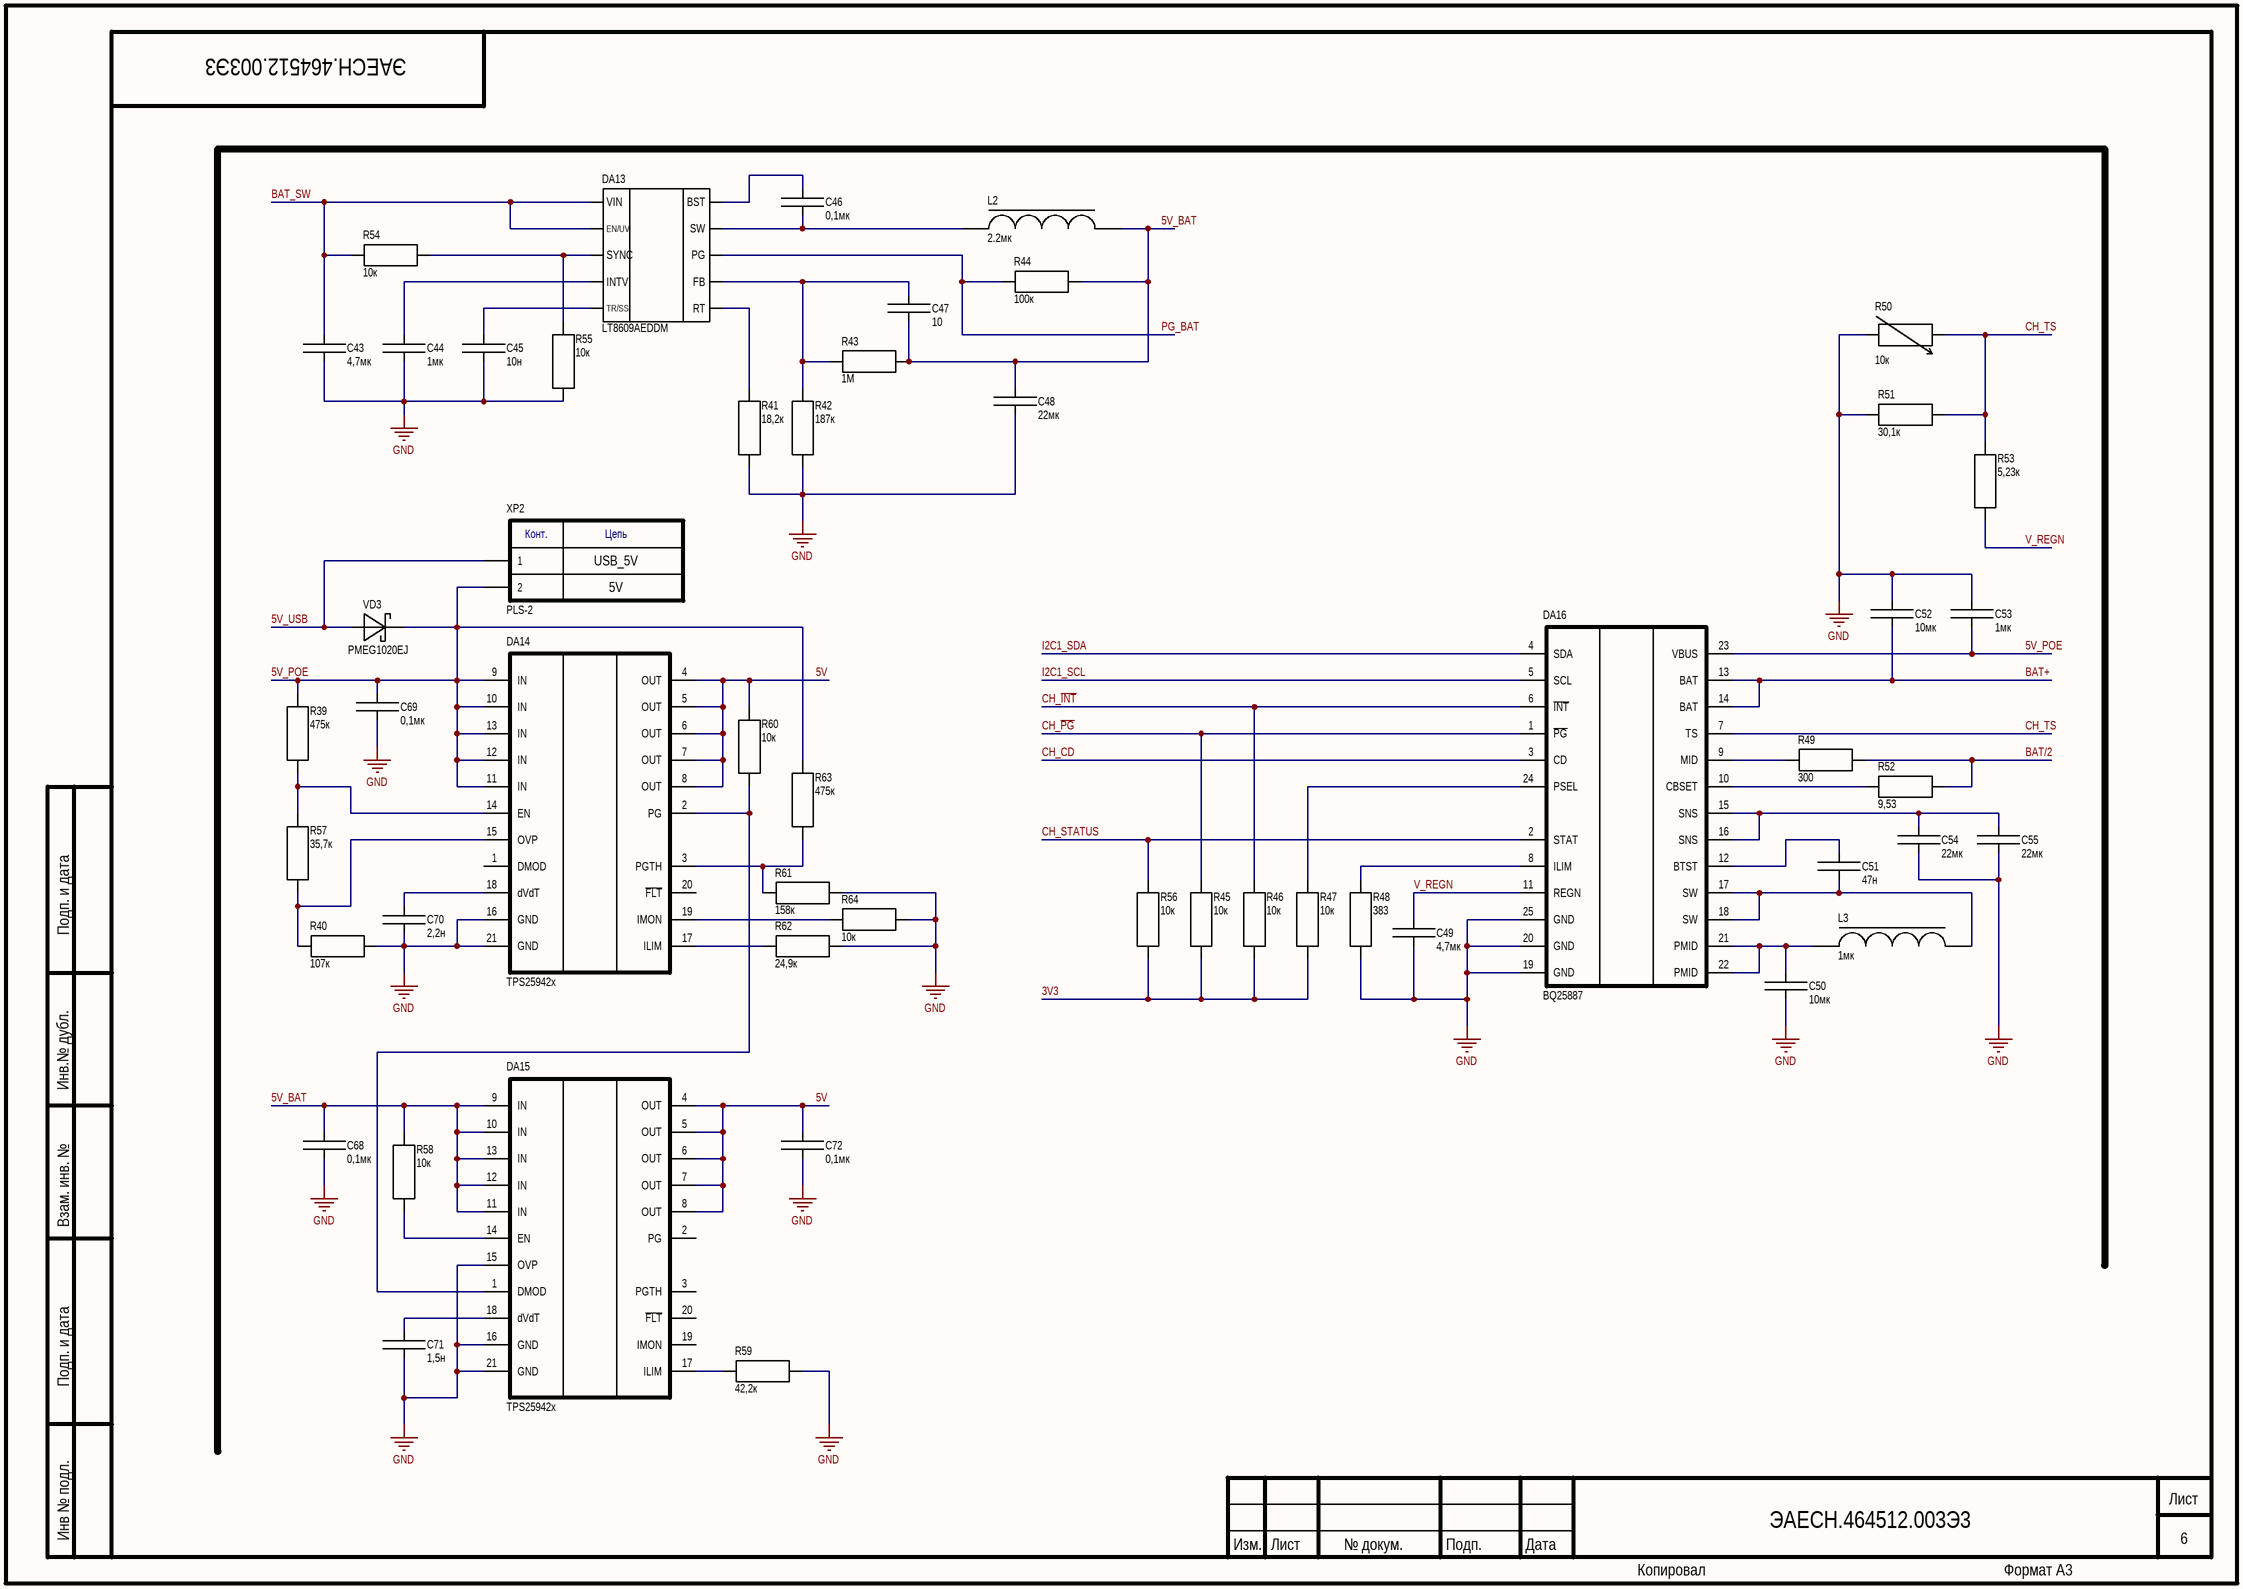
[diagram p5: Sheet6.SchDoc]

### Parts
C43  value 4,7мк  [С0603]  (hidden comment: C)
C44  value 1мк  [С0603]  (hidden comment: C)
C45  value 10н  [С0603]  (hidden comment: C)
C46  value 0,1мк  [С0603]  (hidden comment: C)
C47  value 10  [С0603]  (hidden comment: C)
C48  value 22мк  [C1206]  (hidden comment: C)
C49  value 4,7мк  [С0603]  (hidden comment: C)
C50  value 10мк  [С0603]  (hidden comment: C)
C51  value 47н  [С0603]  (hidden comment: C)
C52  value 10мк  [С0603]  (hidden comment: C)
C53  value 1мк  [С0603]  (hidden comment: C)
C54  value 22мк  [C1206]  (hidden comment: C)
C55  value 22мк  [C1206]  (hidden comment: C)
C68  value 0,1мк  [С0603]  (hidden comment: C)
C69  value 0,1мк  [С0603]  (hidden comment: C)
C70  value 2,2н  [С0603]  (hidden comment: C)
C71  value 1,5н  [С0603]  (hidden comment: C)
C72  value 0,1мк  [С0603]  (hidden comment: C)
DA13  LT8609AEDDM  [SON-10]
DA14  TPS25942x  [WQFN-20]
DA15  TPS25942x  [WQFN-20]
DA16  BQ25887  [VQFN-24]
L2  2.2мк  [IND_6.5x6.5_VISHAY]
L3  1мк  [IND_6.5x6.5_VISHAY]
R39  value 475к  [R0603]  (hidden comment: R)
R40  value 107к  [R0603]  (hidden comment: R)
R41  value 18,2к  [R0603]  (hidden comment: R)
R42  value 187к  [R0603]  (hidden comment: R)
R43  value 1М  [R0603]  (hidden comment: R)
R44  value 100к  [R0603]  (hidden comment: R)
R45  value 10к  [R0603]  (hidden comment: R)
R46  value 10к  [R0603]  (hidden comment: R)
R47  value 10к  [R0603]  (hidden comment: R)
R48  value 383  [R0603]  (hidden comment: R)
R49  value 300  [R0603]  (hidden comment: R)
R50  value 10к  [R0603]  (hidden comment: EWTF03-103H3T-N)
R51  value 30,1к  [R0603]  (hidden comment: R)
R52  value 9,53  [R0603]  (hidden comment: R)
R53  value 5,23к  [R0603]  (hidden comment: R)
R54  value 10к  [R0603]  (hidden comment: R)
R55  value 10к  [R0603]  (hidden comment: R)
R56  value 10к  [R0603]  (hidden comment: R)
R57  value 35,7к  [R0603]  (hidden comment: R)
R58  value 10к  [R0603]  (hidden comment: R)
R59  value 42,2к  [R0603]  (hidden comment: R)
R60  value 10к  [R0603]  (hidden comment: R)
R61  value 158к  [R0603]  (hidden comment: R)
R62  value 24,9к  [R0603]  (hidden comment: R)
R63  value 475к  [R0603]  (hidden comment: R)
R64  value 10к  [R0603]  (hidden comment: R)
VD3  PMEG1020EJ  [SOD323F]
XP2  PLS-2  [PLS-2]

### Nets
GND: C43.2 C44.2 C45.2 C48.2 C49.2 C50.2 C52.1 C53.1 C54.2 C55.2 C68.2 C69.2 C70.2 C71.2 C72.2 DA14.16(GND) DA14.21(GND) DA15.15(OVP) DA15.16(GND) DA15.21(GND) DA16.19(GND) DA16.20(GND) DA16.25(GND) R40.2 R41.1 R42.2 R48.1 R50.1 R51.1 R55.1 R59.2 R61.1 R62.2 R64.1
3v3: R45.2 R46.2 R47.2 R56.2
5V: C72.1 DA14.4(OUT) DA14.5(OUT) DA14.6(OUT) DA14.7(OUT) DA14.8(OUT) DA15.4(OUT) DA15.5(OUT) DA15.6(OUT) DA15.7(OUT) DA15.8(OUT) R60.2
5V_BAT: C47.1 C48.1 C68.1 DA15.9(IN) DA15.10(IN) DA15.11(IN) DA15.12(IN) DA15.13(IN) L2.1 R43.2 R44.1 R58.2
5V_POE: C53.2 C69.1 DA14.9(IN) DA14.10(IN) DA14.11(IN) DA14.12(IN) DA14.13(IN) DA16.23(VBUS) R39.2 R63.2 VD3.1(C) XP2.2
5V_USB: VD3.2(A) XP2.1
BAT+: C52.2 DA16.13(BAT) DA16.14(BAT)
BAT/2: R49.2 R52.2
BAT_SW: C43.1 DA13.9(VIN) DA13.10(EN/UV) R54.1
CH_CD: DA16.3(CD)
CH_~{INT}: DA16.6(~{INT}) R46.1
CH_~{PG}: DA16.1(~{PG}) R45.1
CH_STATUS: DA16.2(STAT) R56.1
CH_TS: DA16.7(TS) R50.2 R51.2 R53.1
I2C1_SCL: DA16.5(SCL)
I2C1_SDA: DA16.4(SDA)
PG_BAT: DA13.8(PG) R44.2
V_REGN: C49.1 DA16.11(REGN) R53.2
NetC44_1: C44.1 DA13.3(INTV)
NetC45_1: C45.1 DA13.7(TR/SS)
NetC46_1: C46.1 DA13.1(BST)
NetC46_2: C46.2 DA13.2(SW) L2.2
NetC47_2: C47.2 DA13.6(FB) R42.1 R43.1
NetC50_1: C50.1 DA16.21(PMID) DA16.22(PMID) L3.2
NetC51_1: C51.1 DA16.12(BTST)
NetC51_2: C51.2 DA16.17(SW) DA16.18(SW) L3.1
NetC54_1: C54.1 C55.1 DA16.15(SNS) DA16.16(SNS)
NetC70_1: C70.1 DA14.18(dVdT)
NetC71_1: C71.1 DA15.18(dVdT)
NetDA13_4: DA13.4(RT) R41.2
NetDA13_5: DA13.5(SYNC) R54.2 R55.2
NetDA14_2: DA14.2(PG) DA15.1(DMOD) R60.1
NetDA14_3: DA14.3(PGTH) R61.2 R63.1
NetDA14_14: DA14.14(EN) R39.1 R57.2
NetDA14_15: DA14.15(OVP) R40.1 R57.1
NetDA14_17: DA14.17(ILIM) R62.1
NetDA14_19: DA14.19(IMON) R64.2
NetDA15_14: DA15.14(EN) R58.1
NetDA15_17: DA15.17(ILIM) R59.1
NetDA16_8: DA16.8(ILIM) R48.2
NetDA16_9: DA16.9(MID) R49.1
NetDA16_10: DA16.10(CBSET) R52.1
NetDA16_24: DA16.24(PSEL) R47.1

Not connected (* = marked no-connect by the designer): DA14 1(DMOD) 20(~{FLT}); DA15 2(PG) 3(PGTH) 19(IMON) 20(~{FLT})

### Notes on the sheet
- USB_5V
- 5V
- Подп. и дата
- Инв.№ дубл.
- Взам. инв. №
- Инв № подл.
- Изм.
- Лист
- № докум.
- Подп.
- Дата
- Копировал
- Формат А3
- (in symbol 2pin) Конт.; Цепь

### Library data of the parts
L2 = L: PartNumber: IHLP2525CZER2R2MA1
L3 = L: PartNumber: IHLP2525CZER1R0M01
R50 = R_term_n
VD3 = VD_sh
XP2 = 2pin

## Nets that join several sheets
AGND: Sheet2 (15 pins), Sheet4 (8 pins)
GND: Sheet1 (27 pins), Sheet2 (19 pins), Sheet3 (7 pins), Sheet4 (14 pins), Sheet5 (36 pins), Sheet6 (34 pins)
3v3: Sheet1 (22 pins), Sheet2 (14 pins), Sheet3 (R66.2), Sheet4 (6 pins), Sheet5 (22 pins), Sheet6 (R45.2 R46.2 R47.2 R56.2)
5V: Sheet1 (R4.2), Sheet2 (5 pins), Sheet4 (6 pins), Sheet5 (C66.2 DA10.5 X4.1), Sheet6 (12 pins)
5V_ADC: Sheet2 (5 pins), Sheet4 (C62.2 C63.2 DA8.5 DA9.5)
5V_POE: Sheet3 (8 pins), Sheet6 (12 pins)
5V_USB: Sheet4 (R35.1 XS7.1), Sheet6 (VD3.2 XP2.1)
ACC_IN1: Sheet3 (DD2.1), Sheet5 (DD6.11)
ACC_IN2: Sheet3 (DD2.2), Sheet5 (DD6.9)
ADC_CLK: Sheet2 (DA3.3), Sheet3 (DD2.4)
AN1_CONNECTED: Sheet3 (DD2.95), Sheet4 (R24.2 XS5.2)
AN1_SIGNAL: Sheet2 (C38.1 DA1.3), Sheet4 (XS5.3)
AN1_VCC_EN: Sheet3 (DD2.90), Sheet4 (DA8.4)
AN2_CONNECTED: Sheet3 (DD2.98), Sheet4 (R25.2 XS6.2)
AN2_SIGNAL: Sheet2 (C37.1 DA1.5), Sheet4 (XS6.3)
AN2_VCC_EN: Sheet3 (DD2.97), Sheet4 (DA9.4)
BAT+: Sheet2 (SA1.2 X2.4), Sheet5 (X5.1), Sheet6 (C52.2 DA16.13 DA16.14)
BAT/2: Sheet2 (X2.2 X2.3), Sheet6 (R49.2 R52.2)
BAT_MES_EN: Sheet2 (VT1.1), Sheet3 (DD2.96)
BAT_SW: Sheet2 (R7.1 SA1.3), Sheet6 (C43.1 DA13.9 DA13.10 R54.1)
~{CS}_ADC: Sheet2 (R3.7), Sheet3 (DD2.5)
CAN1_RX: Sheet1 (DD1.4), Sheet3 (DD2.81)
CAN1_TX: Sheet1 (DD1.1), Sheet3 (DD2.82)
CAN_CONNECTED: Sheet3 (DD2.87), Sheet4 (R20.2 XS4.2)
CAN_H: Sheet1 (DD1.7 VD1.1), Sheet4 (R23.1 XS4.4)
CAN_L: Sheet1 (DD1.6 VD1.2), Sheet4 (R23.2 XS4.3)
CAN_VCC_EN: Sheet1 (DD1.8), Sheet3 (DD2.85), Sheet4 (DA7.4)
CH_CD: Sheet3 (DD2.37), Sheet6 (DA16.3)
CH_~{INT}: Sheet3 (DD2.35), Sheet6 (DA16.6 R46.1)
CH_~{PG}: Sheet3 (DD2.38), Sheet6 (DA16.1 R45.1)
CH_STATUS: Sheet3 (DD2.36), Sheet6 (DA16.2 R56.1)
GPS_INT: Sheet3 (DD2.3), Sheet5 (DD5.7)
I2C1_SCL: Sheet3 (DD2.92), Sheet5 (DD5.6 DD6.4 R33.2 XS1.61), Sheet6 (DA16.5)
I2C1_SDA: Sheet3 (DD2.93), Sheet5 (DD5.3 DD6.6 R32.1 XS1.62), Sheet6 (DA16.4)
KEY_FLT: Sheet3 (R65.2 R66.1), Sheet4 (5 pins), Sheet5 (DA10.3)
LED_B: Sheet2 (R2.8), Sheet3 (DD2.46)
LED_G: Sheet2 (R2.6), Sheet3 (DD2.45)
LED_R: Sheet2 (R2.7), Sheet3 (DD2.44)
M2_A: Sheet2 (DA3.7), Sheet3 (XS1.20)
NRST: Sheet1 (DD2.14), Sheet2 (C34.1 R28.1 XP1.4)
PG_BAT: Sheet3 (DD2.39), Sheet6 (DA13.8 R44.2)
RS1_A: Sheet2 (DD3.6), Sheet4 (R21.2 XS2.3)
RS1_B: Sheet2 (DD3.7), Sheet4 (R21.1 XS2.4)
RS1_CONNECTED: Sheet3 (DD2.59), Sheet4 (R18.2 XS2.2)
RS1_VCC_EN: Sheet2 (DD3.3), Sheet3 (DD2.60), Sheet4 (DA5.4)
RS2_A: Sheet2 (DD4.6), Sheet4 (R22.2 XS3.3)
RS2_B: Sheet2 (DD4.7), Sheet4 (R22.1 XS3.4)
RS2_CONNECTED: Sheet3 (DD2.89), Sheet4 (R19.2 XS3.2)
RS2_VCC_EN: Sheet2 (DD4.3), Sheet3 (DD2.88), Sheet4 (DA6.4)
SPI1_MOSI: Sheet2 (R3.5), Sheet3 (DD2.91)
SPI2_MISO: Sheet3 (XS1.10), Sheet5 (DD7.2)
SPI2_MOSI: Sheet3 (XS1.9), Sheet5 (DD7.5)
SPI2_SCK: Sheet3 (DD2.47 XS1.8), Sheet5 (DD7.6)
SPI3_CONNECTED: Sheet3 (DD2.62), Sheet5 (R27.2 XS8.2)
SPI3_CS3: Sheet3 (DD2.83), Sheet5 (XS8.8)
SPI3_CS4: Sheet3 (DD2.84), Sheet5 (XS8.9)
SPI3_VCC_EN: Sheet3 (DD2.61), Sheet5 (DA10.4)
USART1_RX: Sheet1 (DD2.69), Sheet2 (DD3.1)
USART1_TX: Sheet1 (DD2.68), Sheet2 (DD3.4)
USART2_TX: Sheet2 (DD4.4), Sheet3 (DD2.86)
USB_CON: Sheet3 (DD2.58), Sheet4 (R35.2 R36.2)
USB_D_N: Sheet3 (DD2.53), Sheet4 (R34.2)
USB_D_P: Sheet3 (DD2.54), Sheet4 (R38.2)